# Altium project SurvBot-RCU.PrjPcb
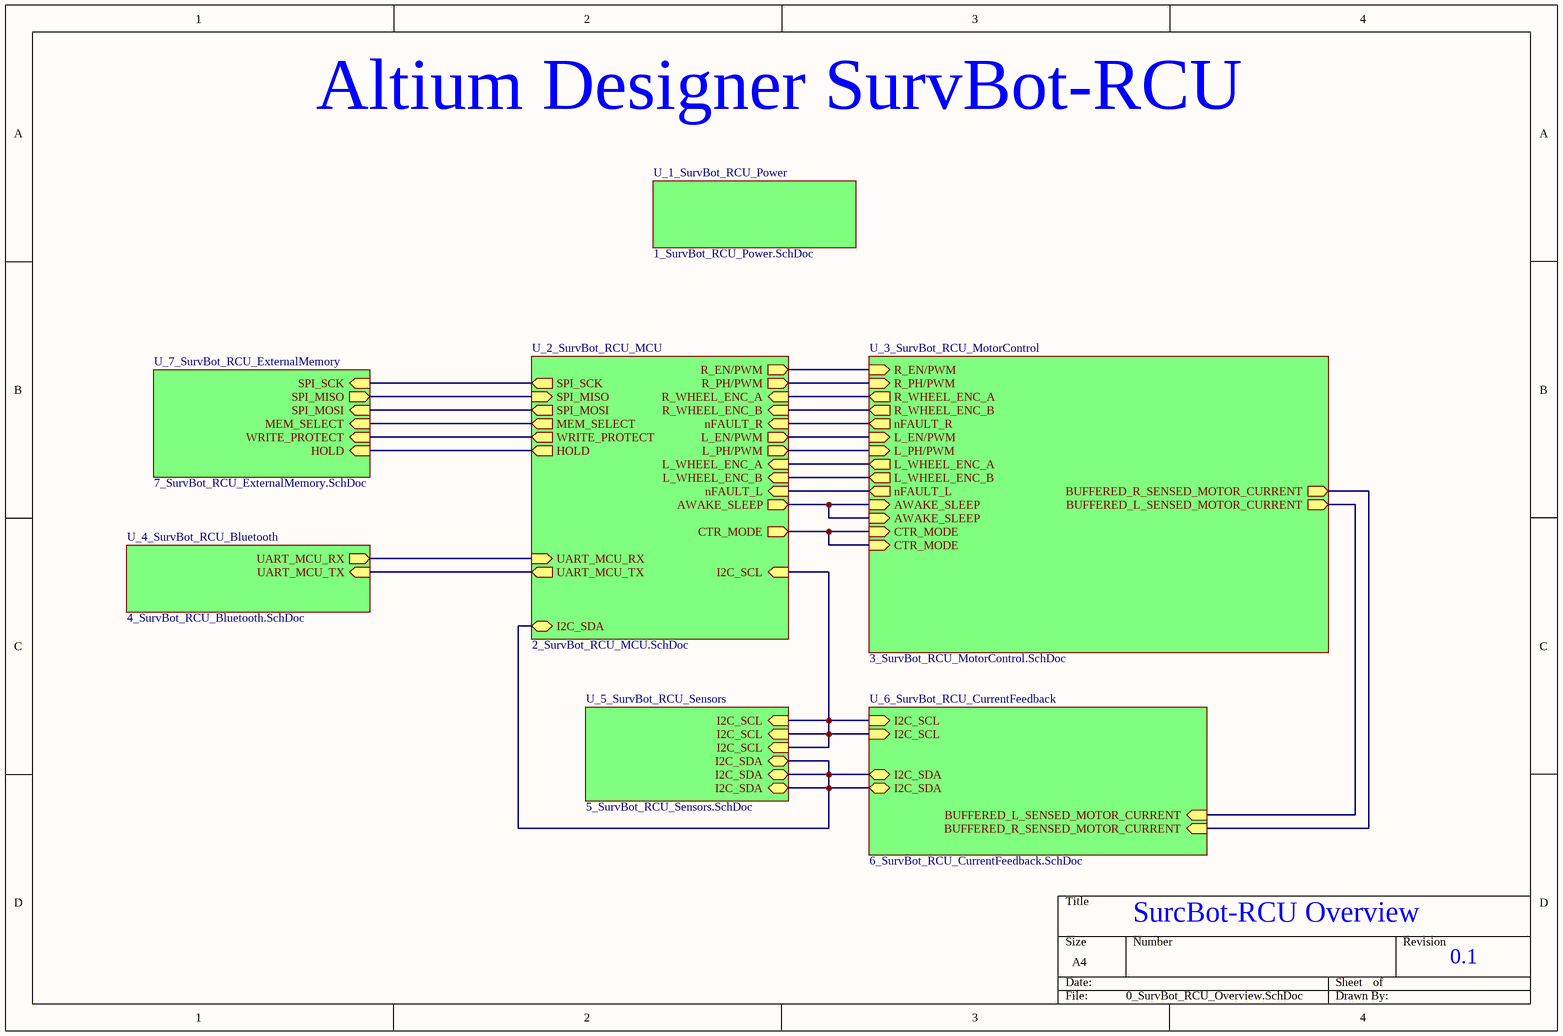
[diagram p0: 0_SurvBot_RCU_Overview.SchDoc]
8 sheets, 149 parts. Net scope: hierarchical (ports join the sheet entries above them; power ports are global).
Board file: SurvBot_RCU.PcbDoc
Sheets:
  0_SurvBot_RCU_Overview.SchDoc
    U_1_SurvBot_RCU_Power = 1_SurvBot_RCU_Power.SchDoc
    U_2_SurvBot_RCU_MCU = 2_SurvBot_RCU_MCU.SchDoc
    U_3_SurvBot_RCU_MotorControl = 3_SurvBot_RCU_MotorControl.SchDoc
    U_6_SurvBot_RCU_CurrentFeedback = 6_SurvBot_RCU_CurrentFeedback.SchDoc
    U_5_SurvBot_RCU_Sensors = 5_SurvBot_RCU_Sensors.SchDoc
    U_4_SurvBot_RCU_Bluetooth = 4_SurvBot_RCU_Bluetooth.SchDoc
    U_7_SurvBot_RCU_ExternalMemory = 7_SurvBot_RCU_ExternalMemory.SchDoc

## Sheet 0_SurvBot_RCU_Overview.SchDoc
size A4; SheetNumber: 1; SheetTotal: 8

### Sub-sheets
U_1_SurvBot_RCU_Power = 1_SurvBot_RCU_Power.SchDoc: no entries
U_2_SurvBot_RCU_MCU = 2_SurvBot_RCU_MCU.SchDoc: R_PH/PWM (out), R_EN/PWM (out), L_WHEEL_ENC_A (in), L_WHEEL_ENC_B (in), L_PH/PWM (out), L_EN/PWM (out), MEM_SELECT (out), SPI_MOSI (out), SPI_MISO (in), SPI_SCK (out), WRITE_PROTECT (out), HOLD (out), nFAULT_L (in), nFAULT_R (in), UART_MCU_TX (out), UART_MCU_RX (in), CTR_MODE (out), AWAKE_SLEEP (out), R_WHEEL_ENC_A (in), R_WHEEL_ENC_B (in), I2C_SDA (bidir), I2C_SCL (in)
U_3_SurvBot_RCU_MotorControl = 3_SurvBot_RCU_MotorControl.SchDoc: R_EN/PWM (in), R_PH/PWM (in), CTR_MODE (in), nFAULT_R (out), BUFFERED_R_SENSED_MOTOR_CURRENT (out), BUFFERED_L_SENSED_MOTOR_CURRENT (out), R_WHEEL_ENC_A (out), R_WHEEL_ENC_B (out), L_WHEEL_ENC_A (out), L_WHEEL_ENC_B (out), AWAKE_SLEEP (in), L_EN/PWM (in), L_PH/PWM (in), nFAULT_L (out), AWAKE_SLEEP (in), CTR_MODE (in)
U_4_SurvBot_RCU_Bluetooth = 4_SurvBot_RCU_Bluetooth.SchDoc: UART_MCU_TX (in), UART_MCU_RX (out)
U_5_SurvBot_RCU_Sensors = 5_SurvBot_RCU_Sensors.SchDoc: I2C_SDA (bidir), I2C_SCL (in), I2C_SDA (bidir), I2C_SCL (in), I2C_SDA (bidir), I2C_SCL (in)
U_6_SurvBot_RCU_CurrentFeedback = 6_SurvBot_RCU_CurrentFeedback.SchDoc: I2C_SCL (in), I2C_SDA (bidir), BUFFERED_R_SENSED_MOTOR_CURRENT (in), I2C_SCL (in), I2C_SDA (bidir), BUFFERED_L_SENSED_MOTOR_CURRENT (in)
U_7_SurvBot_RCU_ExternalMemory = 7_SurvBot_RCU_ExternalMemory.SchDoc: MEM_SELECT (in), SPI_MOSI (in), SPI_MISO (out), SPI_SCK (in), WRITE_PROTECT (in), HOLD (in)

### Nets
AWAKE_SLEEP: sheet U_2_SurvBot_RCU_MCU/AWAKE_SLEEP, sheet U_3_SurvBot_RCU_MotorControl/AWAKE_SLEEP, sheet U_3_SurvBot_RCU_MotorControl/AWAKE_SLEEP
BUFFERED_L_SENSED_MOTOR_CURRENT: sheet U_3_SurvBot_RCU_MotorControl/BUFFERED_L_SENSED_MOTOR_CURRENT, sheet U_6_SurvBot_RCU_CurrentFeedback/BUFFERED_L_SENSED_MOTOR_CURRENT
BUFFERED_R_SENSED_MOTOR_CURRENT: sheet U_3_SurvBot_RCU_MotorControl/BUFFERED_R_SENSED_MOTOR_CURRENT, sheet U_6_SurvBot_RCU_CurrentFeedback/BUFFERED_R_SENSED_MOTOR_CURRENT
CTR_MODE: sheet U_2_SurvBot_RCU_MCU/CTR_MODE, sheet U_3_SurvBot_RCU_MotorControl/CTR_MODE, sheet U_3_SurvBot_RCU_MotorControl/CTR_MODE
HOLD: sheet U_2_SurvBot_RCU_MCU/HOLD, sheet U_7_SurvBot_RCU_ExternalMemory/HOLD
I2C_SCL: sheet U_2_SurvBot_RCU_MCU/I2C_SCL, sheet U_6_SurvBot_RCU_CurrentFeedback/I2C_SCL, sheet U_6_SurvBot_RCU_CurrentFeedback/I2C_SCL, sheet U_5_SurvBot_RCU_Sensors/I2C_SCL, sheet U_5_SurvBot_RCU_Sensors/I2C_SCL, sheet U_5_SurvBot_RCU_Sensors/I2C_SCL
I2C_SDA: sheet U_2_SurvBot_RCU_MCU/I2C_SDA, sheet U_6_SurvBot_RCU_CurrentFeedback/I2C_SDA, sheet U_6_SurvBot_RCU_CurrentFeedback/I2C_SDA, sheet U_5_SurvBot_RCU_Sensors/I2C_SDA, sheet U_5_SurvBot_RCU_Sensors/I2C_SDA, sheet U_5_SurvBot_RCU_Sensors/I2C_SDA
L_EN/PWM: sheet U_2_SurvBot_RCU_MCU/L_EN/PWM, sheet U_3_SurvBot_RCU_MotorControl/L_EN/PWM
L_PH/PWM: sheet U_2_SurvBot_RCU_MCU/L_PH/PWM, sheet U_3_SurvBot_RCU_MotorControl/L_PH/PWM
L_WHEEL_ENC_A: sheet U_2_SurvBot_RCU_MCU/L_WHEEL_ENC_A, sheet U_3_SurvBot_RCU_MotorControl/L_WHEEL_ENC_A
L_WHEEL_ENC_B: sheet U_2_SurvBot_RCU_MCU/L_WHEEL_ENC_B, sheet U_3_SurvBot_RCU_MotorControl/L_WHEEL_ENC_B
MEM_SELECT: sheet U_2_SurvBot_RCU_MCU/MEM_SELECT, sheet U_7_SurvBot_RCU_ExternalMemory/MEM_SELECT
nFAULT_L: sheet U_2_SurvBot_RCU_MCU/nFAULT_L, sheet U_3_SurvBot_RCU_MotorControl/nFAULT_L
nFAULT_R: sheet U_2_SurvBot_RCU_MCU/nFAULT_R, sheet U_3_SurvBot_RCU_MotorControl/nFAULT_R
R_EN/PWM: sheet U_2_SurvBot_RCU_MCU/R_EN/PWM, sheet U_3_SurvBot_RCU_MotorControl/R_EN/PWM
R_PH/PWM: sheet U_2_SurvBot_RCU_MCU/R_PH/PWM, sheet U_3_SurvBot_RCU_MotorControl/R_PH/PWM
R_WHEEL_ENC_A: sheet U_2_SurvBot_RCU_MCU/R_WHEEL_ENC_A, sheet U_3_SurvBot_RCU_MotorControl/R_WHEEL_ENC_A
R_WHEEL_ENC_B: sheet U_2_SurvBot_RCU_MCU/R_WHEEL_ENC_B, sheet U_3_SurvBot_RCU_MotorControl/R_WHEEL_ENC_B
SPI_MISO: sheet U_2_SurvBot_RCU_MCU/SPI_MISO, sheet U_7_SurvBot_RCU_ExternalMemory/SPI_MISO
SPI_MOSI: sheet U_2_SurvBot_RCU_MCU/SPI_MOSI, sheet U_7_SurvBot_RCU_ExternalMemory/SPI_MOSI
SPI_SCK: sheet U_2_SurvBot_RCU_MCU/SPI_SCK, sheet U_7_SurvBot_RCU_ExternalMemory/SPI_SCK
UART_MCU_RX: sheet U_2_SurvBot_RCU_MCU/UART_MCU_RX, sheet U_4_SurvBot_RCU_Bluetooth/UART_MCU_RX
UART_MCU_TX: sheet U_2_SurvBot_RCU_MCU/UART_MCU_TX, sheet U_4_SurvBot_RCU_Bluetooth/UART_MCU_TX
WRITE_PROTECT: sheet U_2_SurvBot_RCU_MCU/WRITE_PROTECT, sheet U_7_SurvBot_RCU_ExternalMemory/WRITE_PROTECT

### Notes on the sheet
- Altium Designer SurvBot-RCU
- SurcBot-RCU Overview
- 0.1

## Sheet 1_SurvBot_RCU_Power.SchDoc
size A3; SheetNumber: 2; SheetTotal: 8
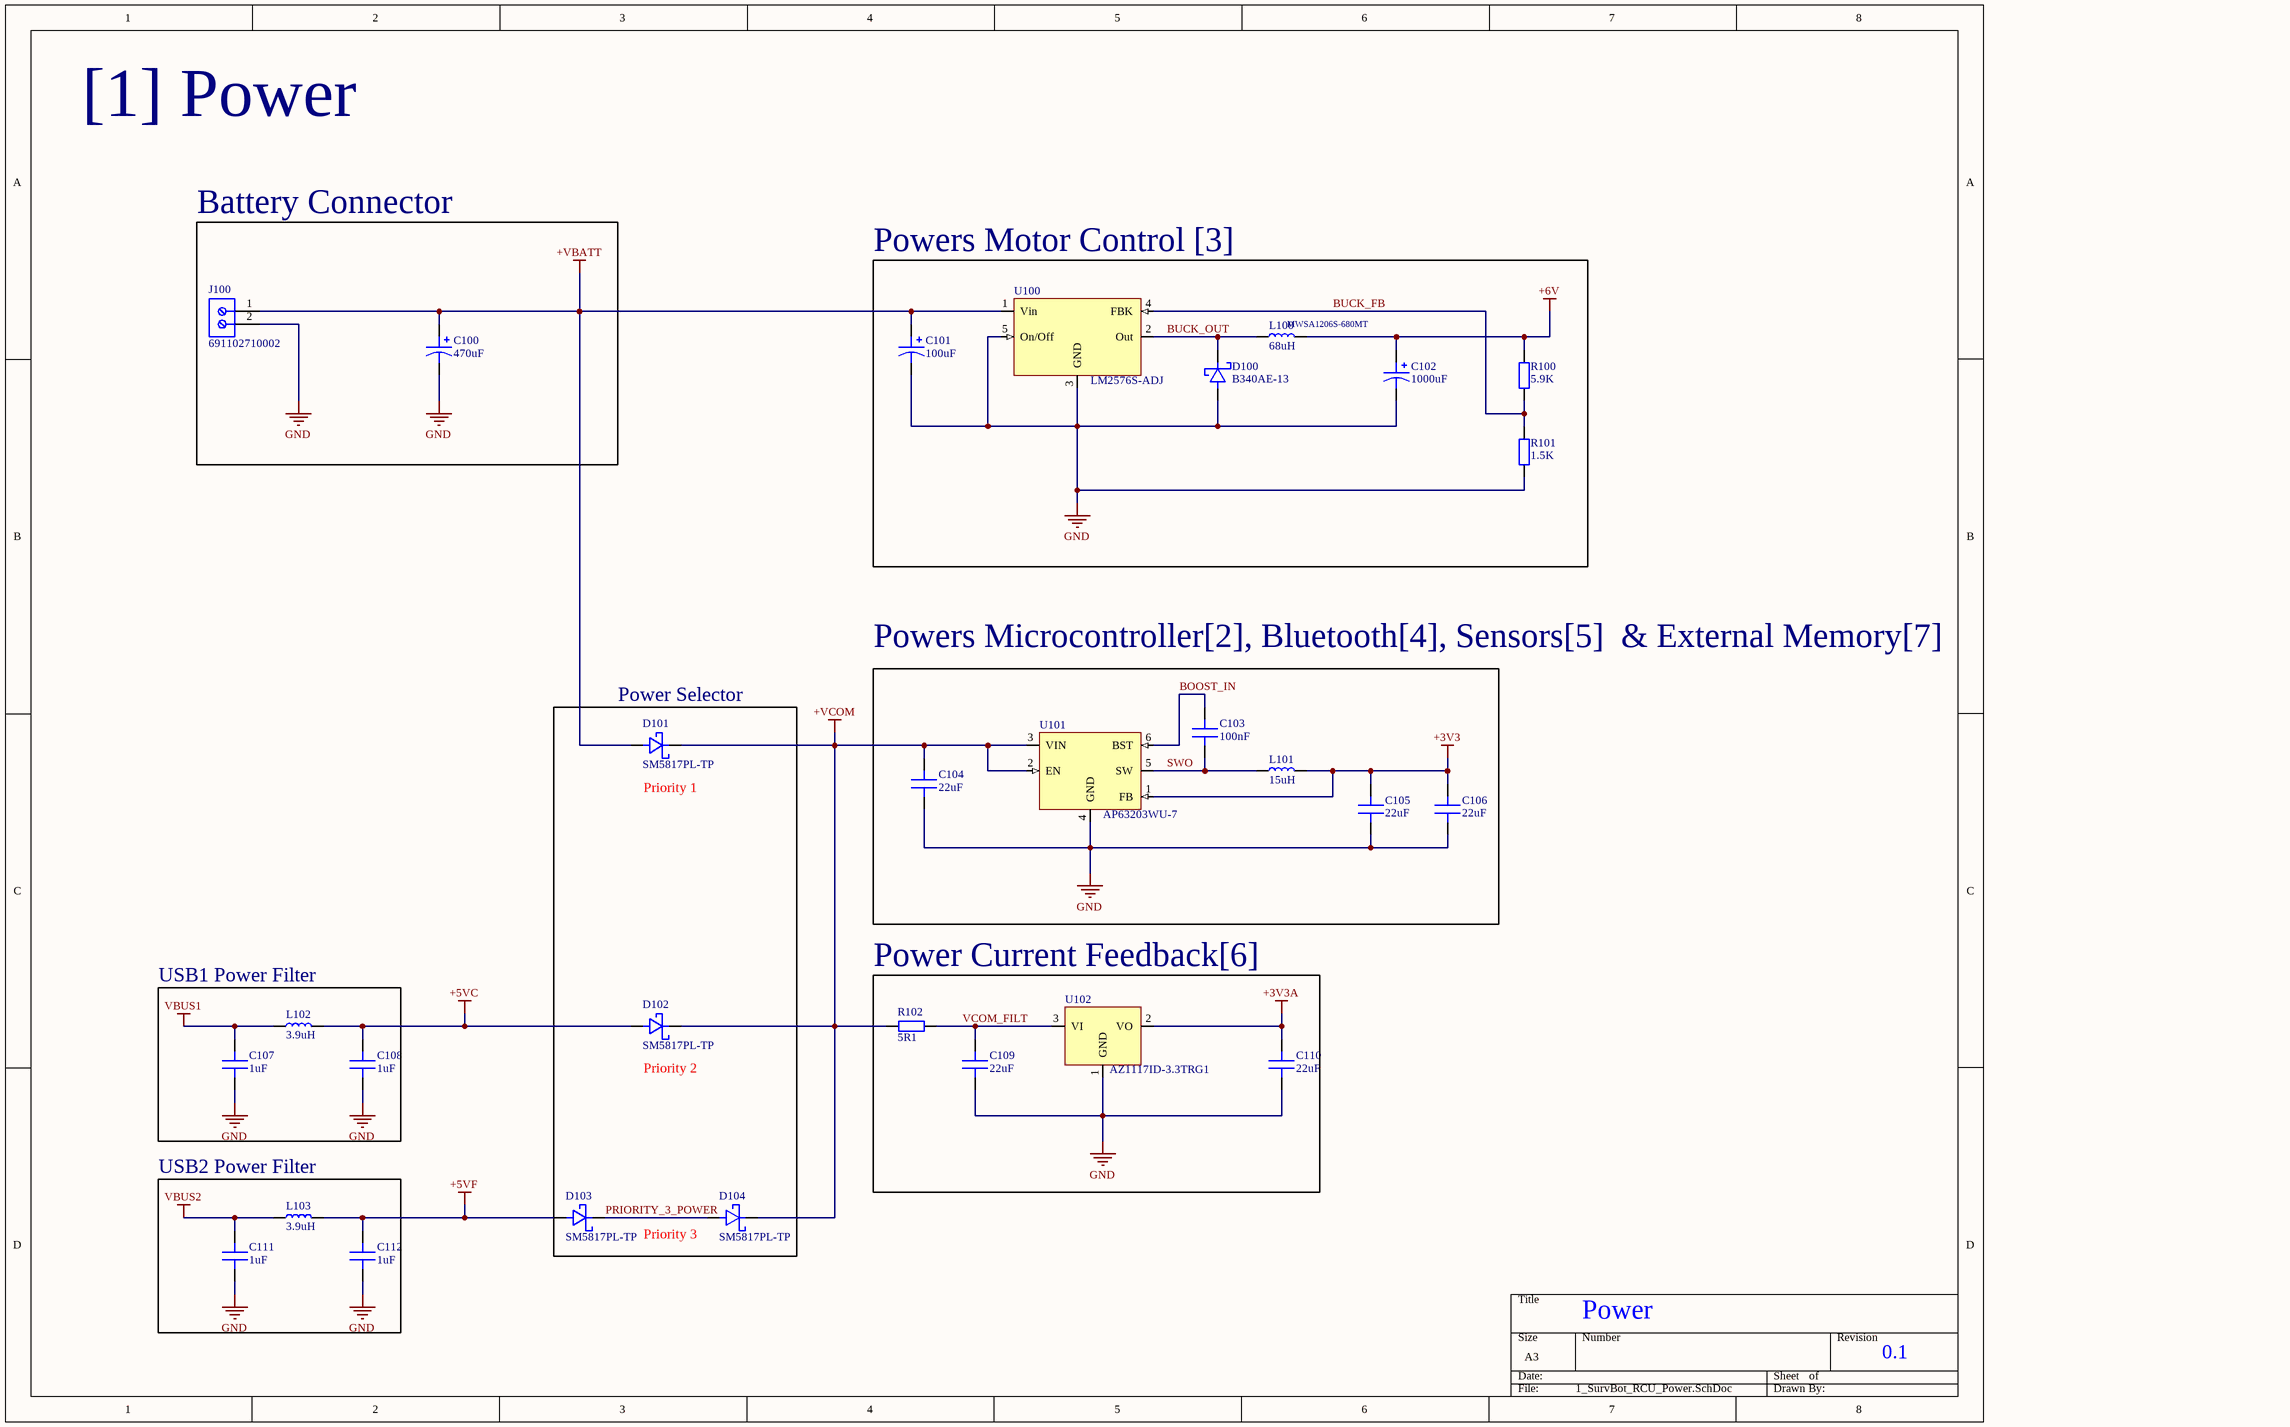
[diagram p1: 1_SurvBot_RCU_Power.SchDoc]

### Parts
C100  470uF  [CAP-THT_RADIAL_D10.00mm_P5.00mm]
C101  100uF  [CAP-THT-Radial__D8.0mmP3.5mm]
C102  1000uF  [CAP-THT_RADIAL_D10.00mm_P5.00mm]
C103  100nF  [CAP_0603]
C104  22uF  [CAP_0603]
C105  22uF  [CAP_0603]
C106  22uF  [CAP_0603]
C107  1uF  [CAP_0603]
C108  1uF  [CAP_0603]
C109  22uF  [CAP_0603]
C110  22uF  [CAP_0603]
C111  1uF  [CAP_0603]
C112  1uF  [CAP_0603]
D100  B340AE-13  [DO-214AC, SMA]
D101  SM5817PL-TP  [DIO-SOD-123FL]
D102  SM5817PL-TP  [DIO-SOD-123FL]
D103  SM5817PL-TP  [DIO-SOD-123FL]
D104  SM5817PL-TP  [DIO-SOD-123FL]
J100  691102710002  [691102710002]
L100  68uH  [IND-SMD_13.45x12.45mm]
L101  15uH  [IND-SMD_ 4.90x4.90mm]
L102  3.9uH  [IND_SMD-3.00MMX3.00MM]
L103  3.9uH  [IND_SMD-3.00MMX3.00MM]
R100  5.9K  [RES_0603]
R101  1.5K  [RES_0603]
R102  5R1  [RES_1206]
U100  LM2576S-ADJ  [TO-263-6, D2PAK (5 Leads + Tab), TO-263BA]
U101  AP63203WU-7  [SOT-23-6 Thin, TSOT-23-6]
U102  AZ1117ID-3.3TRG1  [TO-252-3, DPAK (2 Leads + Tab), SC-63]

### Blocks framed on the sheet
Battery Connector: C100 J100
Powers Motor Control [3]: C101 C102 D100 L100 R100 R101 U100
Power Selector: D101-D104
Power Current Feedback[6]: C109 C110 R102 U102
USB1 Power Filter: C107 C108 L102
USB2 Power Filter: C111 C112 L103

### Nets
+3V3: C105.2 C106.2 L101.2 U101.1(FB)
+3V3A: C110.2 U102.2(VO)
+5VC: C108.2 D102.A L102.2
+5VF: C112.2 D103.A L103.2
+6V: C102.1 L100.2 R100.2
+VBATT: C100.1 C101.1 D101.A J100.1 U100.1(Vin)
+VCOM: C104.2 D101.K D102.K D104.K R102.1 U101.2(EN) U101.3(VIN)
GND: C100.2 C101.2 C102.2 C104.1 C105.1 C106.1 C107.1 C108.1 C109.1 C110.1 C111.1 C112.1 D100.A J100.2 R101.1 U100.3(GND) U100.5(On/Off) U101.4(GND) U102.1(GND)
VBUS1: C107.2 L102.1
VBUS2: C111.2 L103.1
BOOST_IN: C103.2 U101.6(BST)
BUCK_FB: R100.1 R101.2 U100.4(FBK)
BUCK_OUT: D100.K L100.1 U100.2(Out)
PRIORITY_3_POWER: D103.K D104.A
SWO: C103.1 L101.1 U101.5(SW)
VCOM_FILT: C109.2 R102.2 U102.3(VI)

### Notes on the sheet
- [1] Power
- (near L100) MWSA1206S-680MT
- Powers Microcontroller[2], Bluetooth[4], Sensors[5]  & External Memory[7]
- (near D101) Priority 1
- (near D102) Priority 2
- (near D104) Priority 3
- Power
- 0.1

### Library data of the parts
C100 = CAP_470uF-35V-20%-RADIAL-TH: 470 µF 35 V Aluminum Electrolytic Capacitors Radial, Can 10000 Hrs @ 105°C; Manufacturer: Rubycon; Manufacturer Part #: 35ZLH470MEFC10X16; Case/Package: TH,D10xL16mm; Supplier: JLCPCB; Supplier Part #: C338196
C101 = CAP_100uF-50V-20%-RADIAL-TH: 100 µF 50 V Aluminum Electrolytic Capacitors Radial, Can 8000 Hrs @ 105°C; Manufacturer: Rubycon; Manufacturer Part #: 50ZLH100MEFC8X11.5; Case/Package: TH,D8xL11.5mm; Supplier: JLCPCB; Supplier Part #: C109393
C102 = CAP_1000uF-16V-20%-RADIAL-TH: 1000 µF 16 V Aluminum Electrolytic Capacitors Radial, Can 10000 Hrs @ 105°C; Manufacturer: Rubycon; Manufacturer Part #: 16ZLH1000MEFC10X16; Case/Package: TH,D10xL16mm; Supplier: JLCPCB; Supplier Part #: C338175
C103 = CAP_100nF-50V-10%-0603: 0.1 µF ±10% 50V Ceramic Capacitor X7R 0603 (1608 Metric); Manufacturer: KEMET; Manufacturer Part #: C0603C104K5RACAUTO; Case/Package: 0603; Supplier: JLCPCB; Supplier Part #: C129621
C104-C106 C109 C110 = CAP_22uF-10V-20%-0603: 22 µF ±20% 10V Ceramic Capacitor X5R 0603 (1608 Metric); Manufacturer: Samsung Electro-Mechanics; Manufacturer Part #: CL10A226MP8NUNE; Case/Package: 0603; Supplier: JLCPCB; Supplier Part #: C86295
C107 C108 C111 C112 = CAP_1uF-16V-10%-0603: 1 µF ±10% 16V Ceramic Capacitor X7R 0603 (1608 Metric); Manufacturer: YAGEO; Manufacturer Part #: CC0603KRX7R7BB105; Case/Package: 0603; Supplier: JLCPCB; Supplier Part #: C106248
D100 = DIO-S_0.5V-40V-3A-SMA: Diode 40 V 3A Surface Mount SMA; Manufacturer: DIODES INCORPORATED; Manufacturer Part #: B340AE-13; Case/Package: SMA; Supplier: JLCPCB; Supplier Part #: C168859
D101-D104 = DIO-S_0.45V-20V-1A-SOD-123FL: Diode 20 V 1A Surface Mount SOD-123FL; Manufacturer: MCC(Micro Commercial Components); Manufacturer Part #: SM5817PL-TP; Case/Package: SOD-123FL; Supplier: JLCPCB; Supplier Part #: C669022
J100 = CMP-1502-03258-2: NexarPartId: 8917706; Number of Levels: 1; Number of Positions Per Level: 2; Current: 15A; Voltage: 300V; Pitch: 5.0038mm; Plating: Steel; Stripping Length: -6mm; Wire Gauge (Min): 14AWG; Wire Gauge (Max): 22AWG; Length: 7.5mm; Contact Material: Brass; Contact Plating: Tin; Packaging: Box; Number of Pins: 2; Voltage Rating: 300V; Termination: Screw; Number of Contacts: 2; Color: Blue; Current Rating: 15A; Mount: Through Hole; Max Operating Temperature: 105°C; Min Operating Temperature: -40°C; REACH SVHC: Unknown; Height: 13.4mm; Width: 11.2mm; Housing Material: Nylon; RoHS: Compliant; Wire/Cable Gauge: 22AWG; Lead Pitch: 5mm
L100 = IND_68uH-4A-20%-SMD: 68 µH Shielded Drum Core, Wirewound Inductor 4 A 140mOhm Max Nonstandard; Manufacturer: Sunlord; Manufacturer Part #: MWSA1206S-680MT; Case/Package: SMD,13.5x12.6mm; Supplier: JLCPCB; Supplier Part #: C408532
L101 = IND_15uH-1.2A-20%-SMD: 15 µH Shielded Drum Core, Wirewound Inductor 1.2 A 198mOhm Max Nonstandard; Manufacturer: Taiyo Yuden; Manufacturer Part #: NRS5020T150MMGJ; Case/Package: SMD,4.9x4.9mm; Supplier: JLCPCB; Supplier Part #: C222920
L102 L103 = IND_3.9uH-2.1A-20%-SMD: 3.9 µH Shielded Drum Core, Wirewound Inductor 1.5 A 115mOhm Max Nonstandard; Manufacturer: Sunlord; Manufacturer Part #: SPH3015H3R9MT; Case/Package: SMD,3x3mm; Supplier: JLCPCB; Supplier Part #: C431700
R100 = RES_5.9K-100mW-1%-0603: RES 5.9K OHM 1% 100mW SMD-0603 Thick film Resistor; Manufacturer: PANASONIC; Manufacturer Part #: ERJ3EKF5901V; Case/Package: 0603; Supplier: JLCPCB; Supplier Part #: C403290
R101 = RES_1.5K-250mW-1%-0603: RES 1.5K OHM 1% 250mW SMD-0603 Thick film Resistor; Manufacturer: PANASONIC; Manufacturer Part #: ERJPA3F1501V; Case/Package: 0603; Supplier: JLCPCB; Supplier Part Number: C543357
R102 = RES_5R1-600mW-5%-1206: 600mW Thick Film Resistors 200V ±5% ±400ppm/℃ 5.1Ω 1206 Chip Resistor - Surface Mount; Manufacturer: UNI-ROYAL(Uniroyal Elec); Manufacturer Part #: AS0606J051JT5E; Case/Package: 1206; Supplier: JLCPCB; Supplier Part #: C966043
U100 = LM2576S-ADJ: Buck Switching Regulator IC Positive Adjustable 1 Output 3A TO-263-6, D2PAK (5 Leads + Tab), TO-263BA; Manufacturer: UMW(Youtai Semiconductor Co., Ltd.); Manufacturer Part #: LM2576S-ADJ; Case/Package: TO-263-5; Supplier: JLCPCB; Supplier Part #: C347415
U101 = AP63203WU-7 TSOT-23-6: Buck Switching Regulator IC Positive Fixed 3.3V 1 Output 2A SOT-23-6 Thin, TSOT-23-6; Manufacturer: Diodes Incorporated; Manufacturer Part #: AP63203WU-7; Case/Package: TSOT-23-6; Supplier: JLCPCB; Supplier Part #: C780769
U102 = AZ1117ID-3.3TRG1: Linear Voltage Regulator IC Positive Fixed 1 Output 1A TO-252-3; Manufacturer: Diodes Incorporated; Manufacturer Part #: AZ1117ID-3.3TRG1; Case/Package: TO-252-2; Supplier: JLCPCB; Supplier Part #: C2926306

## Sheet 2_SurvBot_RCU_MCU.SchDoc
size A4; SheetNumber: 3; SheetTotal: 8
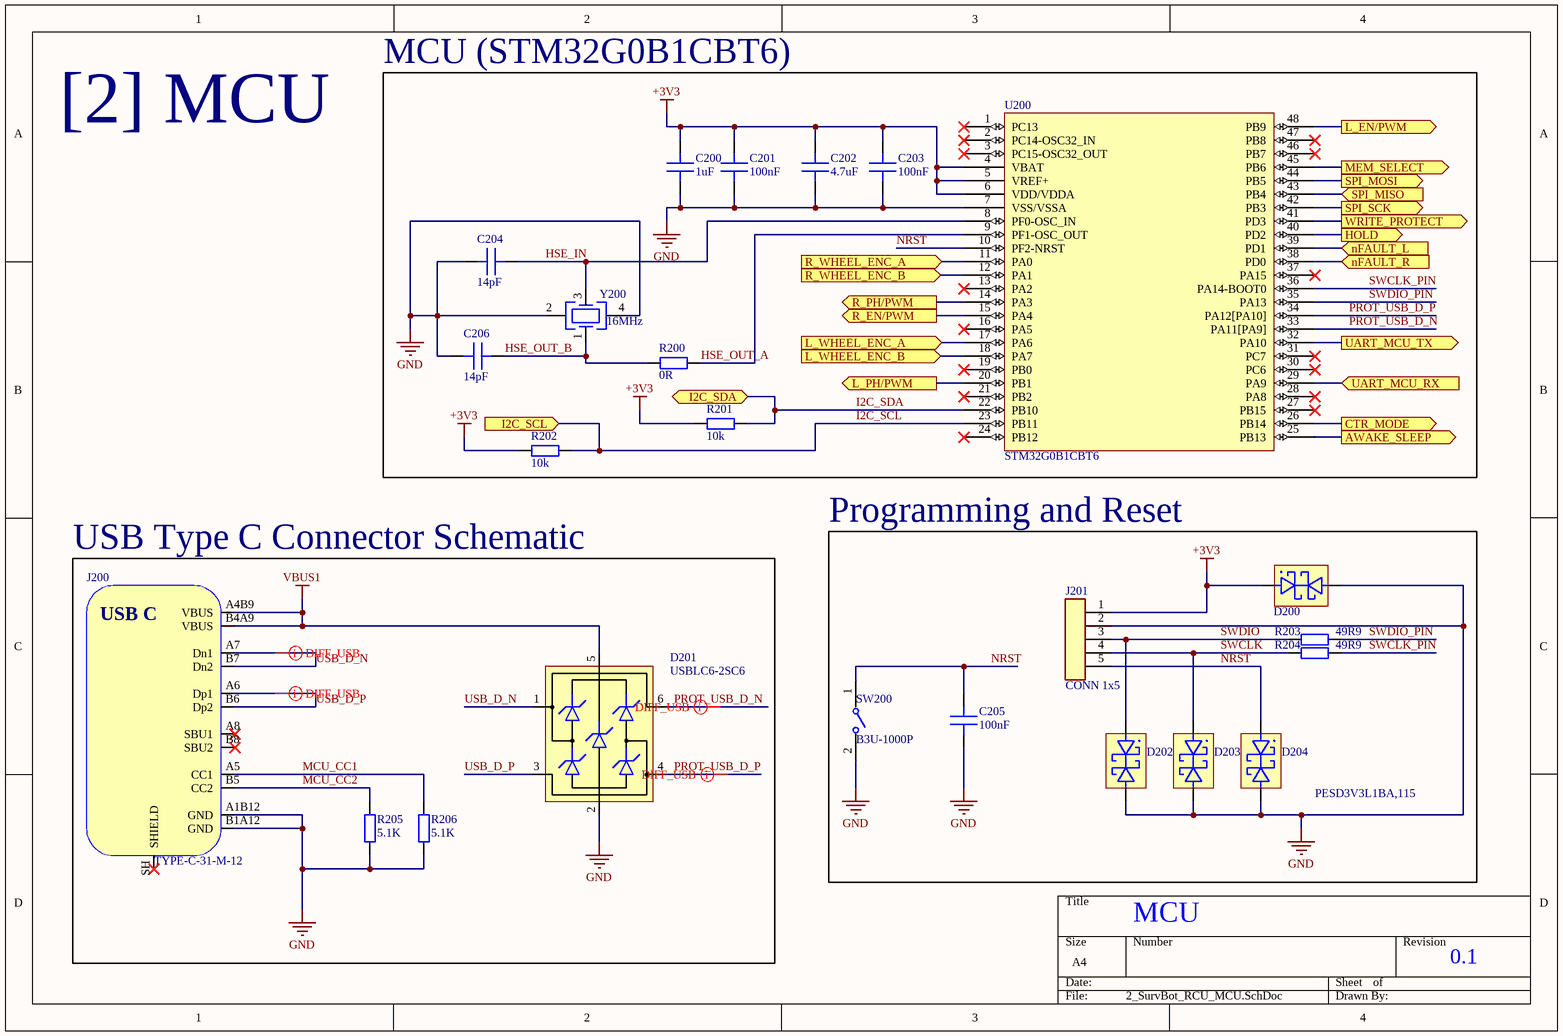
[diagram p2: 2_SurvBot_RCU_MCU.SchDoc]

### Parts
C200  1uF  [CAP_0402]
C201  100nF  [CAP_0402]
C202  4.7uF  [CAP_0402]
C203  100nF  [CAP_0402]
C204  14pF  [CAP_0402]
C205  100nF  [CAP_0402]
C206  14pF  [CAP_0402]
D200  PESD3V3L1BA,115  [SC-76, SOD-323]  (value not drawn)
D201  USBLC6-2SC6  [SOT-23-6]
D202  PESD3V3L1BA,115  [SC-76, SOD-323]  (value not drawn)
D203  PESD3V3L1BA,115  [SC-76, SOD-323]  (value not drawn)
D204  PESD3V3L1BA,115  [SC-76, SOD-323]  (value not drawn)
J200  TYPE-C-31-M-12  [USB4105-GF-A-060]
J201  CONN 1x5  [2541FV-5P]
R200  0R  [RES_0402]
R201  10k  [RES_0402]
R202  10k  [RES_0402]
R203  49R9  [RES_0603]
R204  49R9  [RES_0603]
R205  5.1K  [RES_0603]
R206  5.1K  [RES_0603]
SW200  B3U-1000P  [FP-B3U-1000P-MFG]
U200  STM32G0B1CBT6  [48-LQFP (7x7mm)]
Y200  16MHz  [SMD3225-4P]

### Blocks framed on the sheet
MCU (STM32G0B1CBT6): C200-C204 C206 R200-R202 U200 Y200
USB Type C Connector Schematic: D201 J200 R205 R206
Programming and Reset: C205 D200 D202-D204 J201 R203 R204 SW200

### Ports
AWAKE_SLEEP (out, see 0_SurvBot_RCU_Overview[3B], 3_SurvBot_RCU_MotorControl[4A], 3_SurvBot_RCU_MotorControl[4C]), CTR_MODE (out, see 0_SurvBot_RCU_Overview[3C], 3_SurvBot_RCU_MotorControl[6A], 3_SurvBot_RCU_MotorControl[6C]), HOLD (out, see 0_SurvBot_RCU_Overview[2B], 7_SurvBot_RCU_ExternalMemory[1C]), I2C_SCL (in, see 0_SurvBot_RCU_Overview[3C], 5_SurvBot_RCU_Sensors[1B], 5_SurvBot_RCU_Sensors[2D], 5_SurvBot_RCU_Sensors[3B], 6_SurvBot_RCU_CurrentFeedback[1B], 6_SurvBot_RCU_CurrentFeedback[1C]), I2C_SDA (bidir, see 0_SurvBot_RCU_Overview[2C], 5_SurvBot_RCU_Sensors[1B], 5_SurvBot_RCU_Sensors[2C], 5_SurvBot_RCU_Sensors[3B], 6_SurvBot_RCU_CurrentFeedback[1B], 6_SurvBot_RCU_CurrentFeedback[1C]), L_EN/PWM (out, see 0_SurvBot_RCU_Overview[3B], 3_SurvBot_RCU_MotorControl[4C]), L_PH/PWM (out, see 0_SurvBot_RCU_Overview[3B], 3_SurvBot_RCU_MotorControl[4C]), L_WHEEL_ENC_A (in, see 0_SurvBot_RCU_Overview[3B], 3_SurvBot_RCU_MotorControl[5D]), L_WHEEL_ENC_B (in, see 0_SurvBot_RCU_Overview[3B], 3_SurvBot_RCU_MotorControl[7D]), MEM_SELECT (out, see 0_SurvBot_RCU_Overview[2B], 7_SurvBot_RCU_ExternalMemory[1C]), nFAULT_L (in, see 0_SurvBot_RCU_Overview[3B], 3_SurvBot_RCU_MotorControl[4C]), nFAULT_R (in, see 0_SurvBot_RCU_Overview[3B], 3_SurvBot_RCU_MotorControl[4A]), R_EN/PWM (out, see 0_SurvBot_RCU_Overview[3B], 3_SurvBot_RCU_MotorControl[4A]), R_PH/PWM (out, see 0_SurvBot_RCU_Overview[3B], 3_SurvBot_RCU_MotorControl[4A]), R_WHEEL_ENC_A (in, see 0_SurvBot_RCU_Overview[3B], 3_SurvBot_RCU_MotorControl[5B]), R_WHEEL_ENC_B (in, see 0_SurvBot_RCU_Overview[3B], 3_SurvBot_RCU_MotorControl[6B]), SPI_MISO (in, see 0_SurvBot_RCU_Overview[2B], 7_SurvBot_RCU_ExternalMemory[3C]), SPI_MOSI (out, see 0_SurvBot_RCU_Overview[2B], 7_SurvBot_RCU_ExternalMemory[1C]), SPI_SCK (out, see 0_SurvBot_RCU_Overview[2B], 7_SurvBot_RCU_ExternalMemory[1C]), UART_MCU_RX (in, see 0_SurvBot_RCU_Overview[2C], 4_SurvBot_RCU_Bluetooth[1C]), UART_MCU_TX (out, see 0_SurvBot_RCU_Overview[2C], 4_SurvBot_RCU_Bluetooth[1C]), WRITE_PROTECT (out, see 0_SurvBot_RCU_Overview[2B], 7_SurvBot_RCU_ExternalMemory[1C])

### Nets
+3V3: C200.2 C201.2 C202.2 C203.2 D200.K1 J201.1 R201.1 R202.2 U200.4(VBAT) U200.5(VREF+) U200.6(VDD/VDDA)
GND: C200.1 C201.1 C202.1 C203.1 C204.1 C205.1 C206.1 D200.K2 D201.2(GND) D202.K2 D203.K2 D204.K2 J200.A1B12(GND) J200.B1A12(GND) J201.2 R205.1 R206.1 SW200.2 U200.7(VSS/VSSA) Y200.2(GND) Y200.4(GND)
VBUS1: D201.5(VBUS) J200.A4B9(VBUS) J200.B4A9(VBUS)
AWAKE_SLEEP: U200.25(PB13) ; port AWAKE_SLEEP
CTR_MODE: U200.26(PB14) ; port CTR_MODE
HOLD: U200.40(PD2) ; port HOLD
HSE_IN: C204.2 U200.8(PF0-OSC_IN) Y200.3(OSC)
HSE_OUT_A: R200.2 U200.9(PF1-OSC_OUT)
HSE_OUT_B: C206.2 R200.1 Y200.1(OSC)
I2C_SCL: R202.1 U200.23(PB11) ; port I2C_SCL
I2C_SDA: R201.2 U200.22(PB10) ; port I2C_SDA
L_EN/PWM: U200.48(PB9) ; port L_EN/PWM
L_PH/PWM: U200.20(PB1) ; port L_PH/PWM
L_WHEEL_ENC_A: U200.17(PA6) ; port L_WHEEL_ENC_A
L_WHEEL_ENC_B: U200.18(PA7) ; port L_WHEEL_ENC_B
MCU_CC1: J200.A5(CC1) R206.2
MCU_CC2: J200.B5(CC2) R205.2
MEM_SELECT: U200.45(PB6) ; port MEM_SELECT
nFAULT_L: U200.39(PD1) ; port nFAULT_L
nFAULT_R: U200.38(PD0) ; port nFAULT_R
NRST: C205.2 D204.K1 J201.5 SW200.1 U200.10(PF2-NRST)
PROT_USB_D_N: D201.6(IO1) U200.33(PA11[PA9])
PROT_USB_D_P: D201.4(IO2) U200.34(PA12[PA10])
R_EN/PWM: U200.15(PA4) ; port R_EN/PWM
R_PH/PWM: U200.14(PA3) ; port R_PH/PWM
R_WHEEL_ENC_A: U200.11(PA0) ; port R_WHEEL_ENC_A
R_WHEEL_ENC_B: U200.12(PA1) ; port R_WHEEL_ENC_B
SPI_MISO: U200.43(PB4) ; port SPI_MISO
SPI_MOSI: U200.44(PB5) ; port SPI_MOSI
SPI_SCK: U200.42(PB3) ; port SPI_SCK
SWCLK: D203.K1 J201.4 R204.1
SWCLK_PIN: R204.2 U200.36(PA14-BOOT0)
SWDIO: D202.K1 J201.3 R203.1
SWDIO_PIN: R203.2 U200.35(PA13)
UART_MCU_RX: U200.29(PA9) ; port UART_MCU_RX
UART_MCU_TX: U200.32(PA10) ; port UART_MCU_TX
USB_D_N: D201.1(IO1) J200.A7(Dn1) J200.B7(Dn2)
USB_D_P: D201.3(IO2) J200.A6(Dp1) J200.B6(Dp2)
WRITE_PROTECT: U200.41(PD3) ; port WRITE_PROTECT

Not connected (* = marked no-connect by the designer): J200 A8(SBU1)* B8(SBU2)* SH(SHIELD)*; U200 1(PC13)* 2(PC14-OSC32_IN)* 3(PC15-OSC32_OUT)* 13(PA2)* 16(PA5)* 19(PB0)* 21(PB2)* 24(PB12)* 27(PB15)* 28(PA8)* 30(PC6)* 31(PC7)* 37(PA15)* 46(PB7)* 47(PB8)*

### Layout directives
differential pair; differential pair class USB: PROT_USB_D_N, PROT_USB_D_P, USB_D_N, USB_D_P

### Notes on the sheet
- [2] MCU
- PESD3V3L1BA,115
- MCU
- 0.1
- (in symbol USB4105-GF-A-060_1) USB C

### Library data of the parts
C200 = CAP_1uF-16V-10%-0402: 1 µF ±10% 16V Ceramic Capacitor X5R 0402 (1005 Metric); Manufacturer: Samsung Electro-Mechanics; Manufacturer Part #: CL05A105KO5NNNC; Case/Package: 0402; Supplier: JLCPCB; Supplier Part #: C29266
C201 C203 C205 = CAP_100nF-10V-10%-0402: 0.1 µF ±10% 10V Ceramic Capacitor X7R 0402 (1005 Metric); Manufacturer: Samsung Electro-Mechanics; Manufacturer Part #: CL05B104KP5NNNC; Case/Package: 0402; Supplier: JLCPCB; Supplier Part #: C133086
C202 = CAP_4.7uF-10V-20%-0402: 4.7 µF ±20% 10V Ceramic Capacitor X5R 0402 (1005 Metric); Manufacturer: Samsung Electro-Mechanics; Manufacturer Part #: CL05A475MP5NRNC; Case/Package: 0402; Supplier: JLCPCB; Supplier Part #: Supplier Part #
C204 C206 = CAP_14pF-50V-5%-0402: 50V 14pF NP0 ±5% 0402 Multilayer Ceramic Capacitors MLCC - SMD/SMT ROHS; Manufacturer: Walsin Tech Corp; Manufacturer Part #: 0402N140J500CT; Case/Package: 0402; Supplier: JLCPCB; Supplier Part #: C458857
D200 D202-D204 = DIO-TVS_3.3V-26V-18A-SOD-323: 26V Clamp 18A (8/20µs) Ipp Tvs Diode Surface Mount SOD-323; Manufacturer: Nexperia; Manufacturer Part #: PESD3V3L1BA,115; Case/Package: SOD-323; Supplier: JLCPCB; Supplier Part #: C51450
D201 = USBLC6-2SC6: Low-Capacitance ESD Protection USB; Manufacturer: STMicroelectronics; Manufacturer Part Number: USBLC6-2SC6; Distributor Link: https://www.mouser.de/ProductDetail/STMicroelectronics/USBLC6-2SC6?qs=po45yt2pPpu%2FhNIlwQdTlg%3D%3D
J200 = USB4105-GF-A-060_1: 5A 1 16P Female Type-C SMD USB Connectors ROHS; Manufacturer: Korean Hroparts Elec; Manufacturer Part Number: TYPE-C-31-M-12; Package: SMD; Supplier: JLCPCB; Supplier Part #: C165948
J201 = CONN_5_HDR_0.1-2541FV-5P: 2.54mm 3A Single Row -40℃~+105℃ 250V 5P Direct Insert 1x5P Top Square Hole Plugin,P=2.54mm Female Headers ROHS; Manufacturer: HanElectricity; Manufacturer Part #: 2541FV-5P; Case/Package: P=2.54mm; Supplier: JLCPCB; Supplier Part #: C18723050
R200 = RES_0R-62.5mW-5%-0402: 0 Ohms Jumper Chip Resistor 0402 (1005 Metric) Moisture Resistant Thick Film; Manufacturer: YAGEO; Manufacturer Part #: RC0402JR-070RL; Case/Package: 0402; Supplier: JLCPCB; Supplier Part #: C60485
R201 R202 = RES_10K-62.5mW-1%-0402: 10 kOhms ±1% 0.063W, 1/16W Chip Resistor 0402 (1005 Metric) Moisture Resistant Thick Film; Manufacturer: YAGEO; Manufacturer Part #: RC0402FR-0710KL; Case/Package: 0402; Supplier: JLCPCB; Supplier Part #: C60490
R203 R204 = RES_49.R9-100mW-1%-0603: 49.9 Ohms ±1% 0.1W, 1/10W Chip Resistor 0603 (1608 Metric) Automotive AEC-Q200 Thick Film; Manufacturer: PANASONIC; Manufacturer Part #: ERJ3EKF49R9V; Case/Package: 0603; Supplier: JLCPCB; Supplier Part #: C403255
R205 R206 = RES_5.1K-100mW-1%-0603: 5.1 kOhms ±1% 0.1W, 1/10W Chip Resistor 0603 (1608 Metric) Moisture Resistant Thick Film; Manufacturer: YAGEO; Manufacturer Part #: RC0603FR-075K1L; Case/Package: 0603; Supplier: JLCPCB; Supplier Part #: C105580
SW200 = CMP-2100-03586-2: SWITCH TACTILE SPST-NO 0.05A 12V; Manufacturer: Omron Electronics; Contact Resistance: 100mR; Operating Force: 1.5N; Max Current Rating: 50mA; Switch Travel: 0.15mm; Actuator Type: Standard; Mechanical Life: 200000Cycles; Ratings: Dust Proof; Illumination Type: Non-Illuminated; Throw Configuration: SPST; Actuator Length: 0.4mm; Switch Function: Off-Mom; Height: 1.2mm; Width: 3mm; Weight: 0.000776oz; Contact Material: Silver; Max Voltage Rating (DC): 12V; Insulation Resistance: 100MR; Lead Free: Lead Free; Current Rating: 50mA; Termination: SMD/SMT; Length: 4mm; Voltage Rating (DC): 12V; Contact Current Rating: 50mA; Orientation: Straight; Depth: 2.5mm; Max Operating Temperature: 70°C; Packaging: Tape and Reel; Min Operating Temperature: -25°C; Package Quantity: 1; Mount: Surface Mount; Electrical Life: 200000Cycles; Manufacturer Part #: B3U-1000P; Case/Package: SMD, 2.5x3mm; Supplier: JLCPCB; Supplier Part #: C231329
U200 = STM32G0B1CBT6: ARM® Cortex®-M0+ STM32G0 Microcontroller IC 32-Bit Single-Core 64MHz 128KB (128K x 8) FLASH 48-LQFP (7x7); Manufacturer: STMicroelectronics; Manufacturer Part #: STM32G0B1CBT6; Case/Package: 48-LQFP (7x7); Supplier: JLCPCB; Supplier Part #: C2847904
Y200 = XTAL_16MHz_SMD3225-4P: 16MHz SMD crystal oscillator 12pF ±10ppm ±30ppm SMD3225-4P Crystals ROHS; Manufacturer: SJK(SHENZHEN CRYSTAL TECH); Manufacturer Part #: 7U16000E12UCG; Case/Package: SMD3225-4P; Supplier: JLCPCB; Supplier Part #: C251610

## Sheet 3_SurvBot_RCU_MotorControl.SchDoc
size A3; SheetNumber: 4; SheetTotal: 8
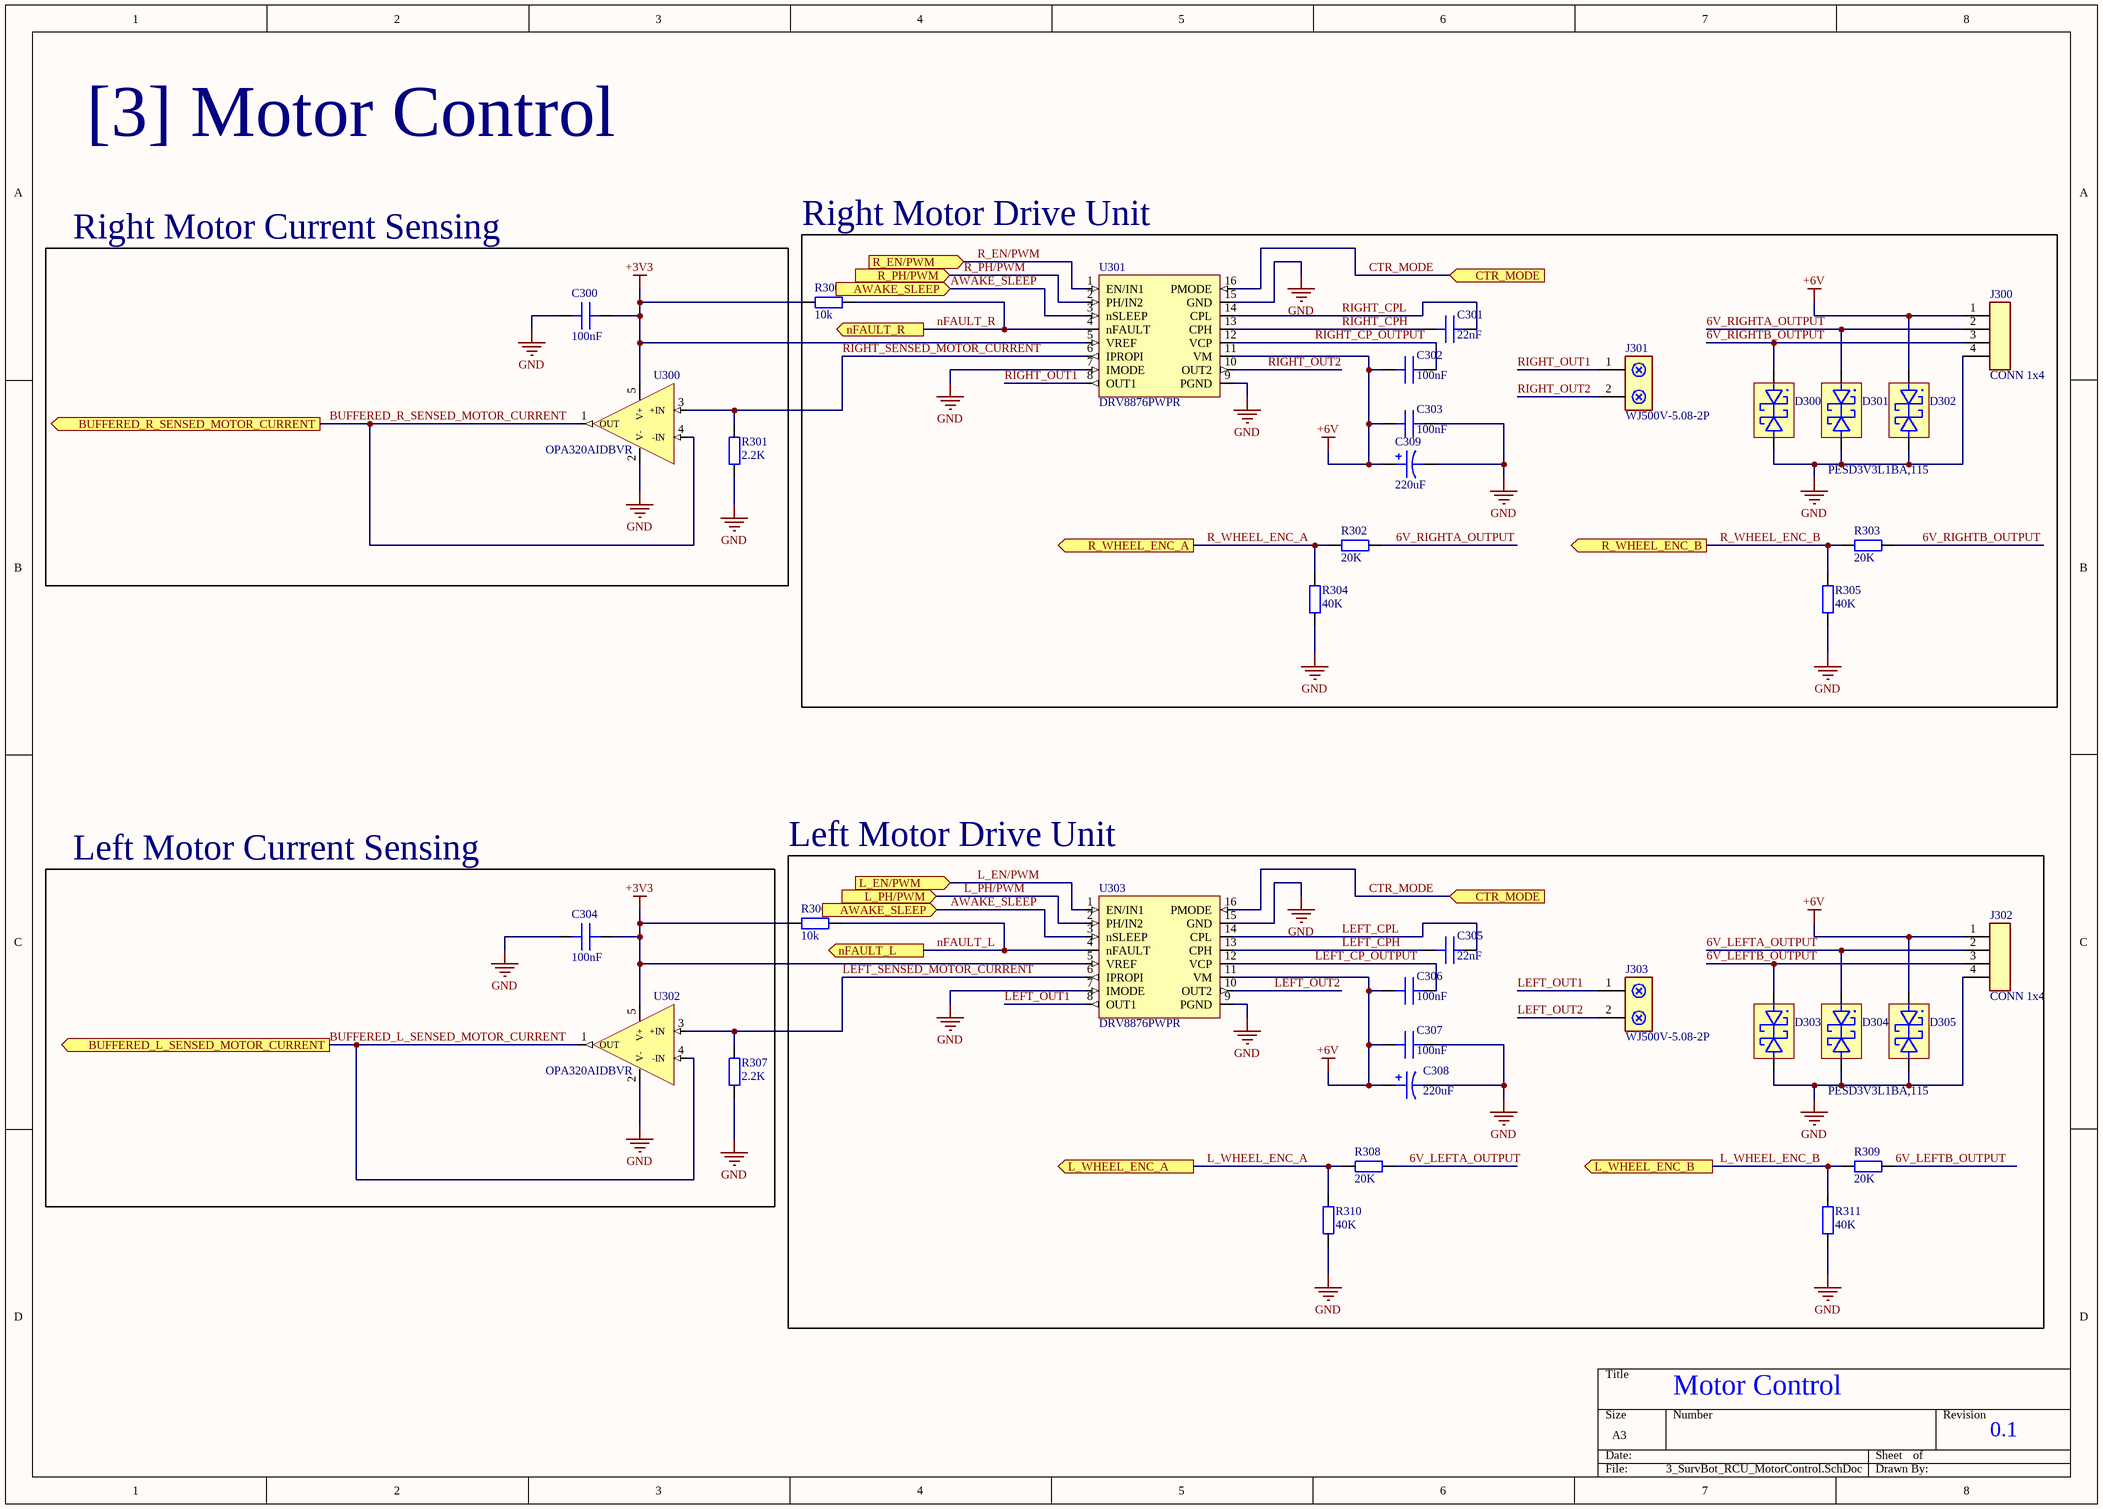
[diagram p3: 3_SurvBot_RCU_MotorControl.SchDoc]

### Parts
C300  100nF  [CAP_0603]
C301  22nF  [CAP_0603]
C302  100nF  [CAP_0603]
C303  100nF  [CAP_0603]
C304  100nF  [CAP_0603]
C305  22nF  [CAP_0603]
C306  100nF  [CAP_0603]
C307  100nF  [CAP_0603]
C308  220uF  [CAP-THT-Radial__D8.0mmP3.5mm]
C309  220uF  [CAP-THT-Radial__D8.0mmP3.5mm]
D300  PESD3V3L1BA,115  [SC-76, SOD-323]  (value not drawn)
D301  PESD3V3L1BA,115  [SC-76, SOD-323]  (value not drawn)
D302  PESD3V3L1BA,115  [SC-76, SOD-323]  (value not drawn)
D303  PESD3V3L1BA,115  [SC-76, SOD-323]  (value not drawn)
D304  PESD3V3L1BA,115  [SC-76, SOD-323]  (value not drawn)
D305  PESD3V3L1BA,115  [SC-76, SOD-323]  (value not drawn)
J300  CONN 1x4  [2541FV-4P]
J301  WJ500V-5.08-2P  [WJ500V-5.08-2P]
J302  CONN 1x4  [2541FV-4P]
J303  WJ500V-5.08-2P  [WJ500V-5.08-2P]
R300  10k  [RES_0402]
R301  2.2K  [RES_0603]
R302  20K  [RES_0603]
R303  20K  [RES_0603]
R304  40K  [RES_0603]
R305  40K  [RES_0603]
R306  10k  [RES_0402]
R307  2.2K  [RES_0603]
R308  20K  [RES_0603]
R309  20K  [RES_0603]
R310  40K  [RES_0603]
R311  40K  [RES_0603]
U300  OPA320AIDBVR  [SOT-23-5]
U301  DRV8876PWPR  [16-HTSSOP]
U302  OPA320AIDBVR  [SOT-23-5]
U303  DRV8876PWPR  [16-HTSSOP]

### Blocks framed on the sheet
Right Motor Drive Unit: C301-C303 C309 D300-D302 J300 J301 R300 R302-R305 U301
Right Motor Current Sensing: C300 R301 U300
Left Motor Current Sensing: C304 R307 U302
Left Motor Drive Unit: C305-C308 D303-D305 J302 J303 R306 R308-R311 U303

### Ports
AWAKE_SLEEP (in, see 0_SurvBot_RCU_Overview[3B], 2_SurvBot_RCU_MCU[4B]), BUFFERED_L_SENSED_MOTOR_CURRENT (out, see 0_SurvBot_RCU_Overview[4B], 6_SurvBot_RCU_CurrentFeedback[3C]), BUFFERED_R_SENSED_MOTOR_CURRENT (out, see 0_SurvBot_RCU_Overview[4B], 6_SurvBot_RCU_CurrentFeedback[3B]), CTR_MODE (in, see 0_SurvBot_RCU_Overview[3C], 2_SurvBot_RCU_MCU[4B]), L_EN/PWM (in, see 0_SurvBot_RCU_Overview[3B], 2_SurvBot_RCU_MCU[4A]), L_PH/PWM (in, see 0_SurvBot_RCU_Overview[3B], 2_SurvBot_RCU_MCU[3B]), L_WHEEL_ENC_A (out, see 0_SurvBot_RCU_Overview[3B], 2_SurvBot_RCU_MCU[3B]), L_WHEEL_ENC_B (out, see 0_SurvBot_RCU_Overview[3B], 2_SurvBot_RCU_MCU[3B]), nFAULT_L (out, see 0_SurvBot_RCU_Overview[3B], 2_SurvBot_RCU_MCU[4A]), nFAULT_R (out, see 0_SurvBot_RCU_Overview[3B], 2_SurvBot_RCU_MCU[4B]), R_EN/PWM (in, see 0_SurvBot_RCU_Overview[3B], 2_SurvBot_RCU_MCU[3B]), R_PH/PWM (in, see 0_SurvBot_RCU_Overview[3B], 2_SurvBot_RCU_MCU[3B]), R_WHEEL_ENC_A (out, see 0_SurvBot_RCU_Overview[3B], 2_SurvBot_RCU_MCU[3B]), R_WHEEL_ENC_B (out, see 0_SurvBot_RCU_Overview[3B], 2_SurvBot_RCU_MCU[3B])

### Nets
+3V3: C300.1 C304.1 R300.1 R306.1 U300.5(V+) U301.5(VREF) U302.5(V+) U303.5(VREF)
+6V: C302.2 C303.2 C306.2 C307.2 C308.1 C309.1 D302.K1 D305.K1 J300.1 J302.1 U301.11(VM) U303.11(VM)
GND: C300.2 C303.1 C304.2 C307.1 C308.2 C309.2 D300.K2 D301.K2 D302.K2 D303.K2 D304.K2 D305.K2 J300.4 J302.4 R301.1 R304.1 R305.1 R307.1 R310.1 R311.1 U300.2(V-) U301.7(IMODE) U301.9(PGND) U301.15(GND) U302.2(V-) U303.7(IMODE) U303.9(PGND) U303.15(GND)
6V_LEFTA_OUTPUT: D304.K1 J302.2 R308.2
6V_LEFTB_OUTPUT: D303.K1 J302.3 R309.2
6V_RIGHTA_OUTPUT: D301.K1 J300.2 R302.2
6V_RIGHTB_OUTPUT: D300.K1 J300.3 R303.2
AWAKE_SLEEP: U301.3(nSLEEP) U303.3(nSLEEP) ; port AWAKE_SLEEP
BUFFERED_L_SENSED_MOTOR_CURRENT: U302.1(OUT) U302.4(-IN) ; port BUFFERED_L_SENSED_MOTOR_CURRENT
BUFFERED_R_SENSED_MOTOR_CURRENT: U300.1(OUT) U300.4(-IN) ; port BUFFERED_R_SENSED_MOTOR_CURRENT
CTR_MODE: U301.16(PMODE) U303.16(PMODE) ; port CTR_MODE
L_EN/PWM: U303.1(EN/IN1) ; port L_EN/PWM
L_PH/PWM: U303.2(PH/IN2) ; port L_PH/PWM
L_WHEEL_ENC_A: R308.1 R310.2 ; port L_WHEEL_ENC_A
L_WHEEL_ENC_B: R309.1 R311.2 ; port L_WHEEL_ENC_B
LEFT_CP_OUTPUT: C306.1 U303.12(VCP)
LEFT_CPH: C305.1 U303.13(CPH)
LEFT_CPL: C305.2 U303.14(CPL)
LEFT_OUT1: J303.1 U303.8(OUT1)
LEFT_OUT2: J303.2 U303.10(OUT2)
LEFT_SENSED_MOTOR_CURRENT: R307.2 U302.3(+IN) U303.6(IPROPI)
nFAULT_L: R306.2 U303.4(nFAULT) ; port nFAULT_L
nFAULT_R: R300.2 U301.4(nFAULT) ; port nFAULT_R
R_EN/PWM: U301.1(EN/IN1) ; port R_EN/PWM
R_PH/PWM: U301.2(PH/IN2) ; port R_PH/PWM
R_WHEEL_ENC_A: R302.1 R304.2 ; port R_WHEEL_ENC_A
R_WHEEL_ENC_B: R303.1 R305.2 ; port R_WHEEL_ENC_B
RIGHT_CP_OUTPUT: C302.1 U301.12(VCP)
RIGHT_CPH: C301.1 U301.13(CPH)
RIGHT_CPL: C301.2 U301.14(CPL)
RIGHT_OUT1: J301.1 U301.8(OUT1)
RIGHT_OUT2: J301.2 U301.10(OUT2)
RIGHT_SENSED_MOTOR_CURRENT: R301.2 U300.3(+IN) U301.6(IPROPI)

### Notes on the sheet
- [3] Motor Control
- PESD3V3L1BA,115
- Motor Control
- 0.1

### Library data of the parts
C300 C302-C304 C306 C307 = CAP_100nF-50V-10%-0603: as C103 on sheet 1_SurvBot_RCU_Power; Case/Package: 0603; Supplier: JLCPCB; Supplier Part #: C129621
C301 C305 = CAP_22nF_100V-10%-0603: 0.022 µF ±10% 100V Ceramic Capacitor X7R 0603 (1608 Metric); Manufacturer: Murata Electronics; Manufacturer Part #: GCM188R72A223KA37D; Case/Package: 0603; Supplier: JLCPCB; Supplier Part #: C161234
C308 C309 = CAP_220uF-35V-20%_RADIAL-TH: 220 µF 35 V Aluminum Electrolytic Capacitors Radial, Can 8000 Hrs @ 105°C; Manufacturer: Rubycon; Manufacturer Part #: 35ZLH220MEFC8X11.5; Case/Package: TH,D8xL11.5mm; Supplier: JLCPCB; Supplier Part #: C107639
D300-D305 = DIO-TVS_3.3V-26V-18A-SOD-323: as D200 on sheet 2_SurvBot_RCU_MCU; Manufacturer Part #: PESD3V3L1BA,115; Case/Package: SOD-323; Supplier: JLCPCB; Supplier Part #: C51450
J300 J302 = CONN_4_HDR_0.1-2541FV-4P: 2.54mm 3A Single Row 4P -40℃~+105℃ 250V Direct Insert 1x4P Top Square Hole Plugin,P=2.54mm Female Headers ROHS; Manufacturer: HanElectricity; Manufacturer Part #: 2541FV-4P; Case/Package: P=2.54mm; Supplier: JLCPCB; Supplier Part #: C18723049
J301 J303 = Terminal_Screw_5.08mm_2P: 1x2P 5.08mm 2.5 1 2 18A -40℃~+105℃ 250V Green 14~30 Direct Insert Plugin,P=5.08mm Screw Terminal Blocks ROHS; Manufacturer: Ningbo Kangnex Elec; Manufacturer Part #: WJ500V-5.08-2P; Case/Package: P=5.08mm; Supplier: JLCPCB; Supplier Part #: C8465
R300 R306 = RES_10K-62.5mW-1%-0402: as R201 on sheet 2_SurvBot_RCU_MCU; Case/Package: 0402; Supplier: JLCPCB; Supplier Part #: C60490
R301 R307 = RES_2.2K-100mW-1%-0603: 2.2 kOhms ±1% 0.1W, 1/10W Chip Resistor 0603 (1608 Metric) Moisture Resistant Thick Film; Manufacturer: YAGEO; Manufacturer Part #: RC0603FR-072K2L; Case/Package: 0603; Supplier: JLCPCB; Supplier Part #: C114662
R302 R303 R308 R309 = RES_20K-100mW-1%-0603: 20 kOhms ±1% 0.1W, 1/10W Chip Resistor 0603 (1608 Metric) Automotive AEC-Q200 Thick Film; Manufacturer: PANASONIC; Manufacturer Part #: ERJ-3EKF2002V; Case/Package: 0603; Supplier: JLCPCB; Supplier Part #: C403057
R304 R305 R310 R311 = RES_40K_100mW-1%-0603: 40 kOhms ±0.1% 0.1W, 1/10W Chip Resistor 0603 (1608 Metric) Anti-Sulfur, Automotive AEC-Q200, Moisture Resistant Thin Film; Manufacturer: YAGEO; Manufacturer Part #: AT0603BRD0740KL; Case/Package: 0603; Supplier: JLCPCB; Supplier Part #: C5455515
U300 U302 = OPAMP-OPA320_R2R_SOT23-5: General Purpose Amplifier 1 Circuit Rail-to-Rail SOT-23-5; Manufacturer: Texas Instruments; Manufacturer Part #: OPA320AIDBVR; Case/Package: SOT-23-5; Supplier: JLCPCB; Supplier Part #: C92494
U301 U303 = MTRDRV-DRV8876-HBridge_4.5-37V_3.5A: DRV8876 H-Bridge Motor Driver With Integrated Current Sense and Regulation 16-HTSSOP; Manufacturer: Texas Instruments; Manufacturer Part #: DRV8876PWPR; Case/Package: HTSSOP-16-EP; Supplier: JLCPCB; Supplier Part #: C575551

## Sheet 6_SurvBot_RCU_CurrentFeedback.SchDoc
size A4; SheetNumber: 7; SheetTotal: 8
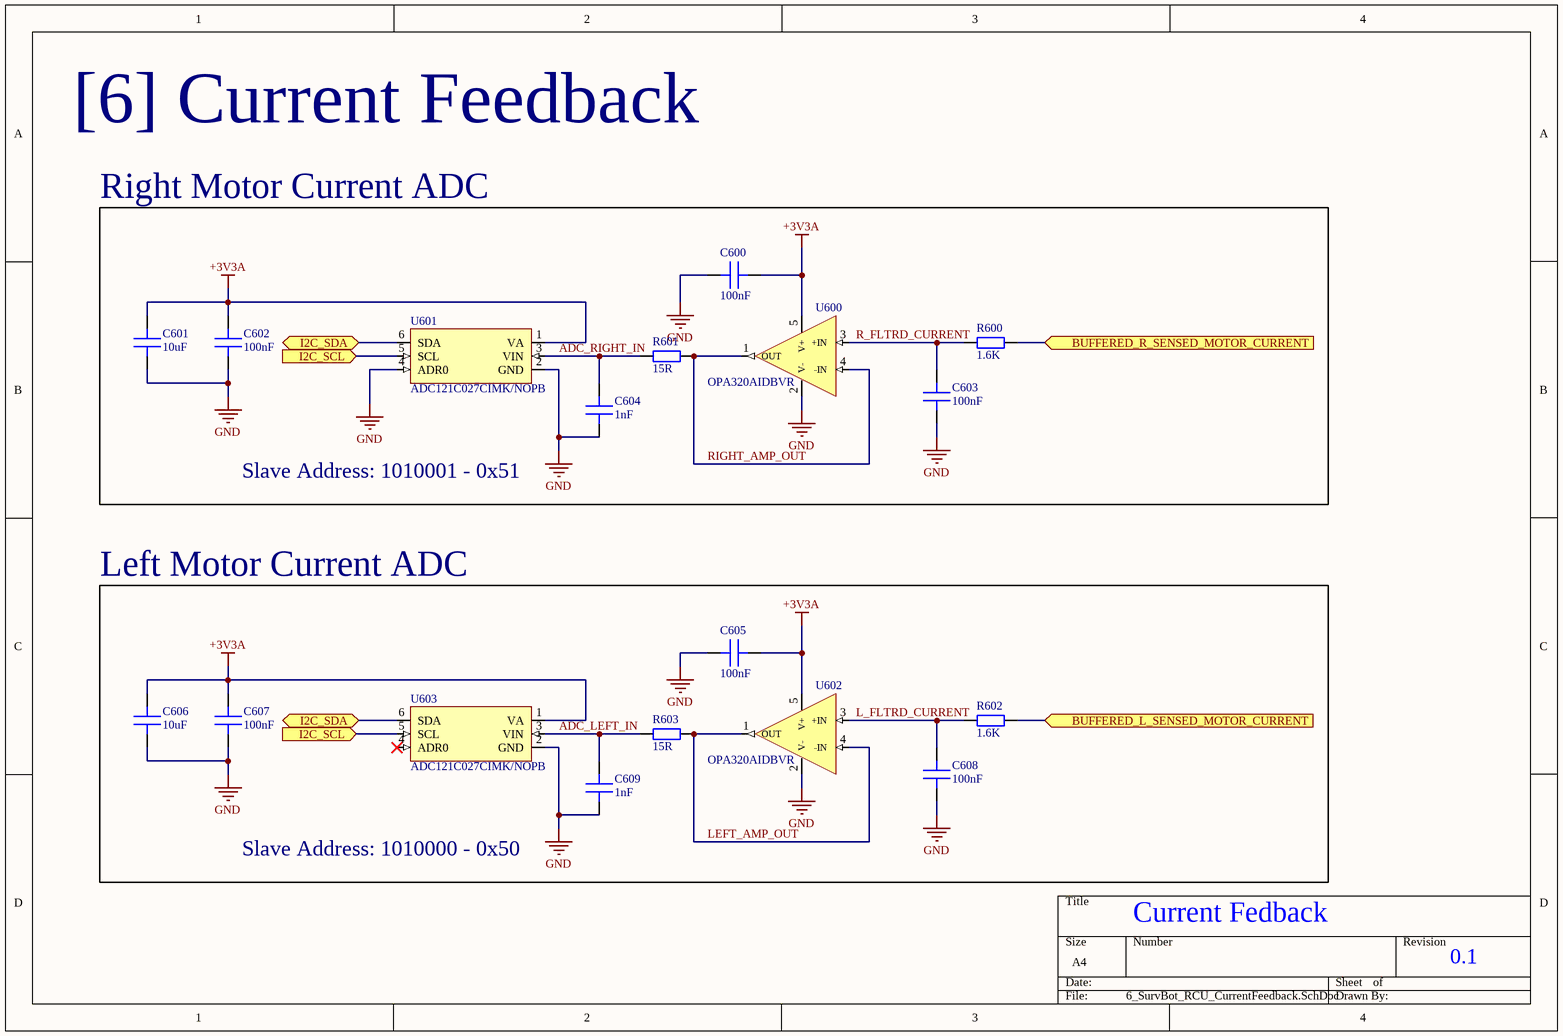
[diagram p4: 6_SurvBot_RCU_CurrentFeedback.SchDoc]

### Parts
C600  100nF  [CAP_0402]
C601  10uF  [CAP_0402]
C602  100nF  [CAP_0402]
C603  100nF  [CAP_0603]
C604  1nF  [CAP_0402]
C605  100nF  [CAP_0402]
C606  10uF  [CAP_0402]
C607  100nF  [CAP_0402]
C608  100nF  [CAP_0603]
C609  1nF  [CAP_0402]
R600  1.6K  [RES_0603]
R601  15R  [RES_0603]
R602  1.6K  [RES_0603]
R603  15R  [RES_0603]
U600  OPA320AIDBVR  [SOT-23-5]
U601  ADC121C027CIMK/NOPB  [SOT-23-6 Thin, TSOT-23-6]
U602  OPA320AIDBVR  [SOT-23-5]
U603  ADC121C027CIMK/NOPB  [SOT-23-6 Thin, TSOT-23-6]

### Blocks framed on the sheet
Right Motor Current ADC: C600-C604 R600 R601 U600 U601
Left Motor Current ADC: C605-C609 R602 R603 U602 U603

### Ports
BUFFERED_L_SENSED_MOTOR_CURRENT (in, see 0_SurvBot_RCU_Overview[4D], 3_SurvBot_RCU_MotorControl[1C]), BUFFERED_R_SENSED_MOTOR_CURRENT (in, see 0_SurvBot_RCU_Overview[4D], 3_SurvBot_RCU_MotorControl[1B]), I2C_SCL (in, see 0_SurvBot_RCU_Overview[3C], 2_SurvBot_RCU_MCU[2B], 5_SurvBot_RCU_Sensors[1B], 5_SurvBot_RCU_Sensors[2D], 5_SurvBot_RCU_Sensors[3B]), I2C_SDA (bidir, see 0_SurvBot_RCU_Overview[3D], 2_SurvBot_RCU_MCU[2B], 5_SurvBot_RCU_Sensors[1B], 5_SurvBot_RCU_Sensors[2C], 5_SurvBot_RCU_Sensors[3B])

### Nets
+3V3A: C600.2 C601.2 C602.2 C605.2 C606.2 C607.2 U600.5(V+) U601.1(VA) U602.5(V+) U603.1(VA)
GND: C600.1 C601.1 C602.1 C603.1 C604.1 C605.1 C606.1 C607.1 C608.1 C609.1 U600.2(V-) U601.2(GND) U601.4(ADR0) U602.2(V-) U603.2(GND)
ADC_LEFT_IN: C609.2 R603.1 U603.3(VIN)
ADC_RIGHT_IN: C604.2 R601.1 U601.3(VIN)
BUFFERED_L_SENSED_MOTOR_CURRENT: R602.2 ; port BUFFERED_L_SENSED_MOTOR_CURRENT
BUFFERED_R_SENSED_MOTOR_CURRENT: R600.2 ; port BUFFERED_R_SENSED_MOTOR_CURRENT
I2C_SCL: U601.5(SCL) U603.5(SCL) ; port I2C_SCL
I2C_SDA: U601.6(SDA) U603.6(SDA) ; port I2C_SDA
L_FLTRD_CURRENT: C608.2 R602.1 U602.3(+IN)
LEFT_AMP_OUT: R603.2 U602.1(OUT) U602.4(-IN)
R_FLTRD_CURRENT: C603.2 R600.1 U600.3(+IN)
RIGHT_AMP_OUT: R601.2 U600.1(OUT) U600.4(-IN)

Not connected (* = marked no-connect by the designer): U603 4(ADR0)*

### Notes on the sheet
- [6] Current Feedback
- Slave Address: 1010001 - 0x51
- Slave Address: 1010000 - 0x50
- Current Fedback
- 0.1

### Library data of the parts
C600 C602 C605 C607 = CAP_100nF-10V-10%-0402: as C201 on sheet 2_SurvBot_RCU_MCU; Case/Package: 0402; Supplier: JLCPCB; Supplier Part #: C133086
C601 C606 = CAP_10uF-10V-20%-0402: 10 µF ±20% 10V Ceramic Capacitor X5R 0402 (1005 Metric); Manufacturer: Murata Electronics; Manufacturer Part #: GRM155R61A106ME11D; Case/Package: 0402; Supplier: JLCPCB; Supplier Part #: C408132
C603 C608 = CAP_100nF-50V-10%-0603: as C103 on sheet 1_SurvBot_RCU_Power; Case/Package: 0603; Supplier: JLCPCB; Supplier Part #: C129621
C604 C609 = CAP_1nF-50V-5%-0402: 1000 pF ±5% 50V Ceramic Capacitor C0G, NP0 0402 (1005 Metric); Manufacturer: Murata Electronics; Manufacturer Part #: GRM1555C1H102JA01D; Case/Package: 0402; Supplier: JLCPCB; Supplier Part #: C76947
R600 R602 = RES_1.6K-100mW-1%-0603: 1.6 kOhms ±1% 0.1W, 1/10W Chip Resistor 0603 (1608 Metric) Moisture Resistant Thick Film; Manufacturer: BOURNS; Manufacturer Part #: CR0603-FX-1601ELF; Case/Package: 0603; Supplier: JLCPCB; Supplier Part #: C203329
R601 R603 = RES_15R-100mW-1%-0603: 15 Ohms ±1% 0.1W, 1/10W Chip Resistor 0603 (1608 Metric) Automotive AEC-Q200 Thick Film; Manufacturer: PANASONIC; Manufacturer Part #: ERJ3EKF15R0V; Case/Package: 0603; Supplier: JLCPCB; Supplier Part #: C403005
U600 U602 = OPAMP-OPA320_R2R_SOT23-5: as U300 on sheet 3_SurvBot_RCU_MotorControl; Manufacturer Part #: OPA320AIDBVR; Case/Package: SOT-23-5; Supplier: JLCPCB; Supplier Part #: C92494
U601 U603 = IC_ADC121C027CIMK/NOPB: 12 Bit Analog to Digital Converter 1 Input 1 SAR TSOT-23-6; Manufacturer: Texas Instruments; Manufacturer Part #: ADC121C027CIMK/NOPB; Case/Package: TSOT-23-6L; Supplier: JLCPCB; Supplier Part #: C201638

## Sheet 5_SurvBot_RCU_Sensors.SchDoc
size A4; SheetNumber: 6; SheetTotal: 8
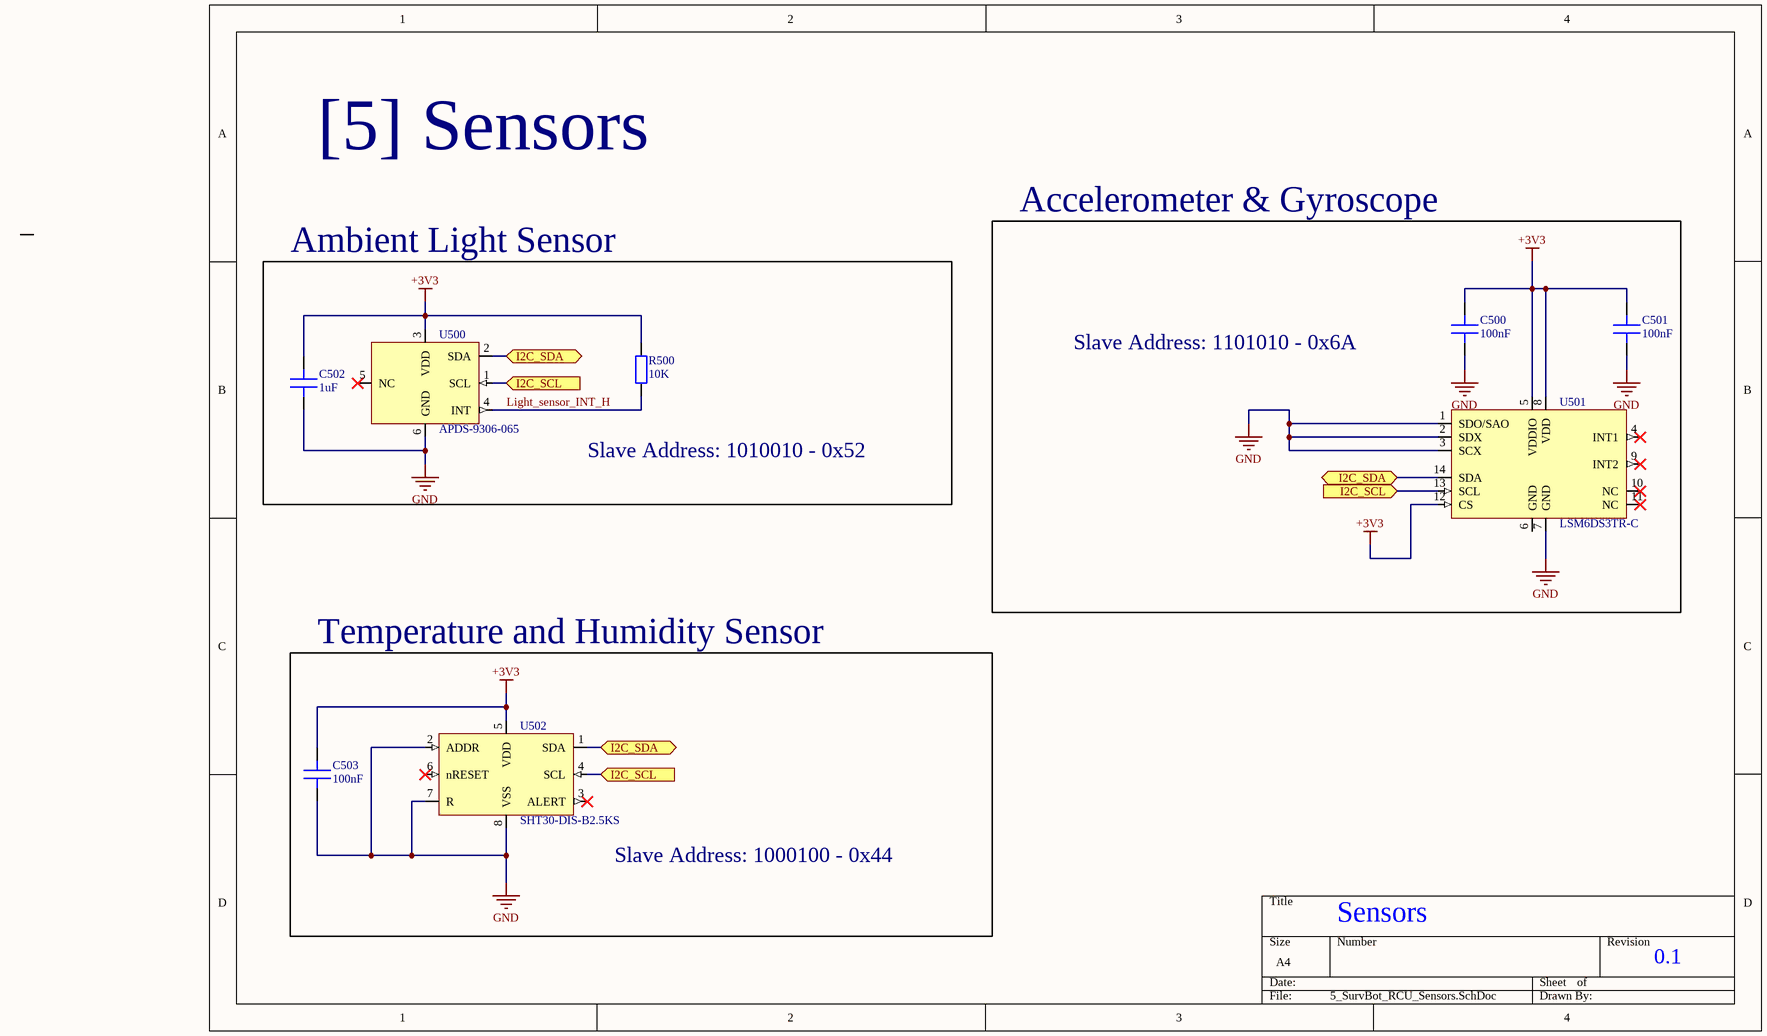
[diagram p5: 5_SurvBot_RCU_Sensors.SchDoc]

### Parts
C500  100nF  [CAP_0603]
C501  100nF  [CAP_0603]
C502  1uF  [CAP_0603]
C503  100nF  [CAP_0603]
R500  10K  [RES_0603]
U500  APDS-9306-065  [APDS-9306-065]
U501  LSM6DS3TR-C  [LGA-14_LSM6DS3TR-C]
U502  SHT30-DIS-B2.5KS  [8-VFDFN Exposed Pad]

### Blocks framed on the sheet
Accelerometer & Gyroscope: C500 C501 U501
Ambient Light Sensor: C502 R500 U500
Temperature and Humidity Sensor: C503 U502

### Ports
I2C_SCL (in, see 0_SurvBot_RCU_Overview[3C], 2_SurvBot_RCU_MCU[2B], 6_SurvBot_RCU_CurrentFeedback[1B], 6_SurvBot_RCU_CurrentFeedback[1C]), I2C_SDA (bidir, see 0_SurvBot_RCU_Overview[3C], 2_SurvBot_RCU_MCU[2B], 6_SurvBot_RCU_CurrentFeedback[1B], 6_SurvBot_RCU_CurrentFeedback[1C])

### Nets
+3V3: C500.2 C501.2 C502.2 C503.2 R500.2 U500.3(VDD) U501.5(VDDIO) U501.8(VDD) U501.12(CS) U502.5(VDD)
GND: C500.1 C501.1 C502.1 C503.1 U500.6(GND) U501.1(SDO/SAO) U501.2(SDX) U501.3(SCX) U501.7(GND) U502.2(ADDR) U502.7(R) U502.8(VSS)
I2C_SCL: U500.1(SCL) U501.13(SCL) U502.4(SCL) ; port I2C_SCL
I2C_SDA: U500.2(SDA) U501.14(SDA) U502.1(SDA) ; port I2C_SDA
Light_sensor_INT_H: R500.1 U500.4(INT)

Not connected (* = marked no-connect by the designer): U500 5(NC)*; U501 4(INT1)* 6(GND) 9(INT2)* 10(NC)* 11(NC)*; U502 3(ALERT)* 6(nRESET)*

### Notes on the sheet
- [5] Sensors
- Slave Address: 1101010 - 0x6A
- Slave Address: 1010010 - 0x52
- (near U502) Slave Address: 1000100 - 0x44
- Sensors
- 0.1

### Library data of the parts
C500 C501 C503 = CAP_100nF-50V-10%-0603: as C103 on sheet 1_SurvBot_RCU_Power; Case/Package: 0603; Supplier: JLCPCB; Supplier Part #: C129621
C502 = CAP_1uF-16V-10%-0603: as C107 on sheet 1_SurvBot_RCU_Power; Case/Package: 0603; Supplier: JLCPCB; Supplier Part #: C106248
R500 = RES_10K-100mW-1%-0603: 10 kOhms ±1% 0.1W, 1/10W Chip Resistor 0603 (1608 Metric) Moisture Resistant Thick Film; Manufacturer: YAGEO; Manufacturer Part #: RC0603FR-0710KL; Case/Package: 0603; Supplier: JLCPCB; Supplier Part #: C98220
U500 = IC_APDS-9306-065: Optical Sensor Ambient 560nm I2C 6-SMD Module; Manufacturer: Broadcom/AVAGO; Manufacturer Part #: APDS-9306-065; Case/Package: 6-SMD Module; Supplier: JLCPCB; Supplier Part #: C2649498
U501 = IC_LSM6DS3TR-C: Accelerometer, Gyroscope, Temperature, 6 Axis Sensor I2C, SPI Output; Manufacturer: STMicroelectronics; Manufacturer Part #: LSM6DS3TR-C; Case/Package: LGA-14(2.5x3); Supplier: JLCPCB; Supplier Part #: C967633
U502 = IC_SHT30-DIS-B2.5KS: Humidity, Temperature 0 ~ 100% RH I2C ±2% RH 8 s Surface Mount; Manufacturer: Sensirion; Manufacturer Part #: SHT30-DIS-B2.5KS; Case/Package: 8-VFDFN Exposed Pad; Supplier: JLCPCB; Supplier Part #: C77361

## Sheet 4_SurvBot_RCU_Bluetooth.SchDoc
size A2; SheetNumber: 5; SheetTotal: 8
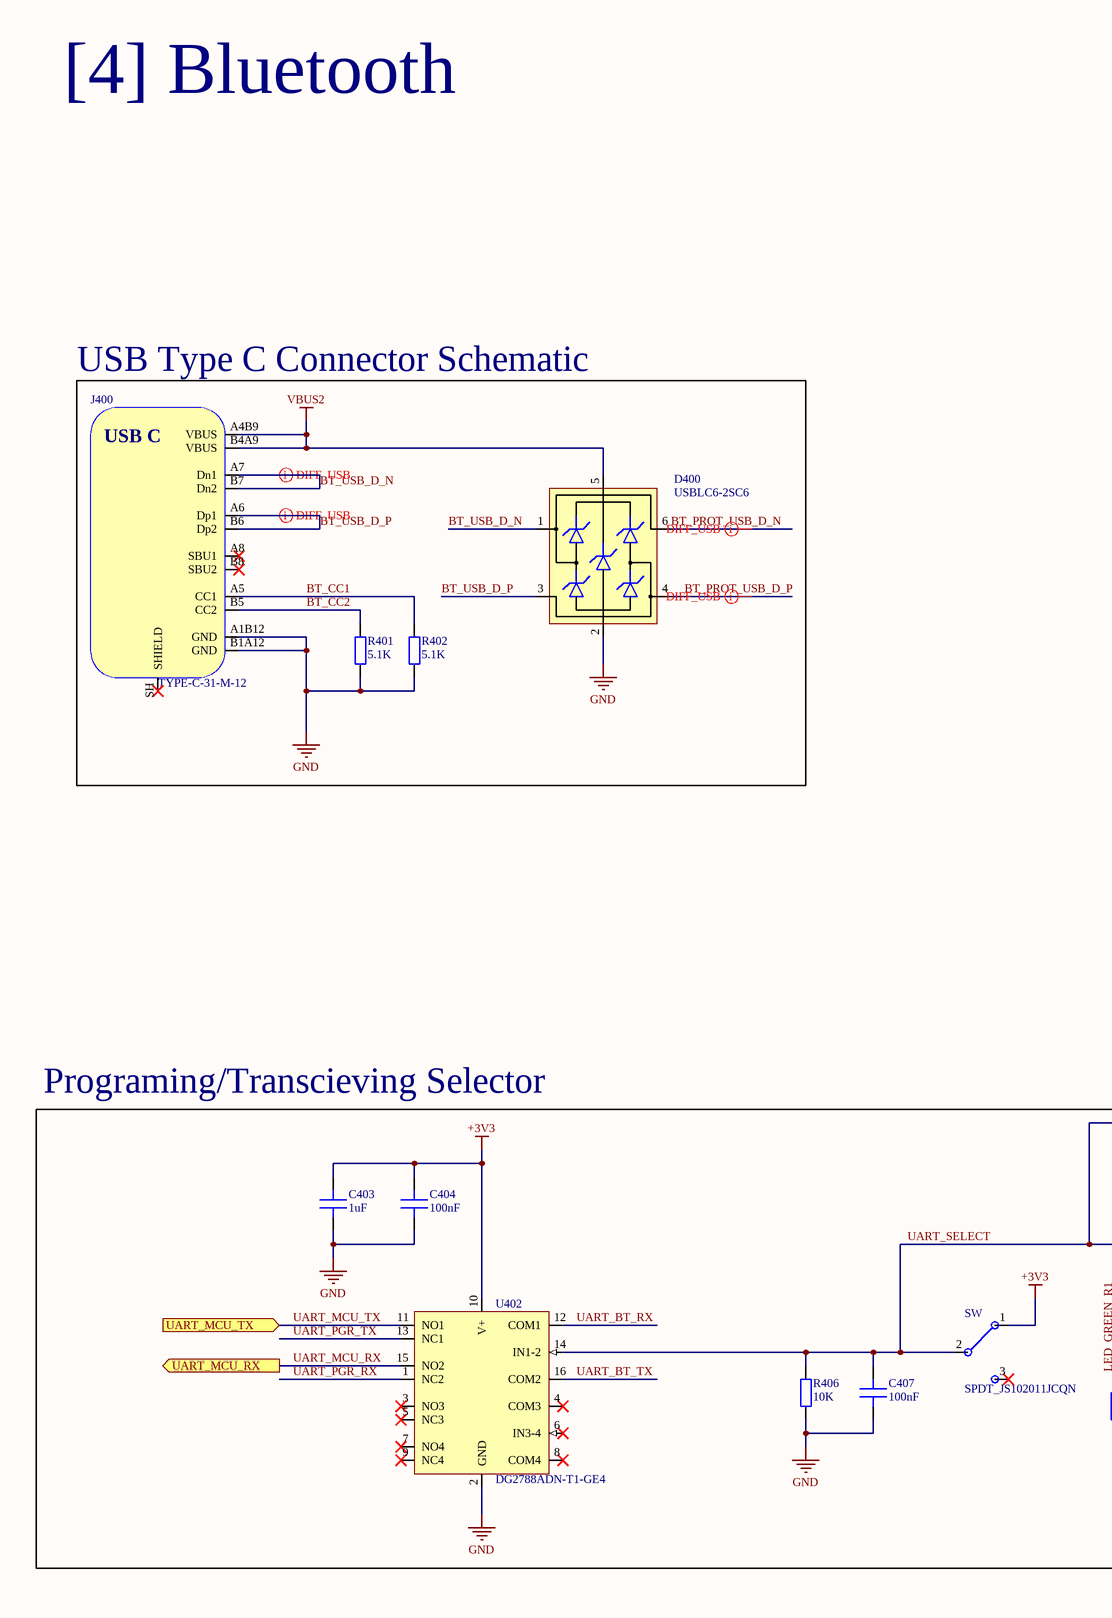
[diagram p6: 4_SurvBot_RCU_Bluetooth.SchDoc, left]
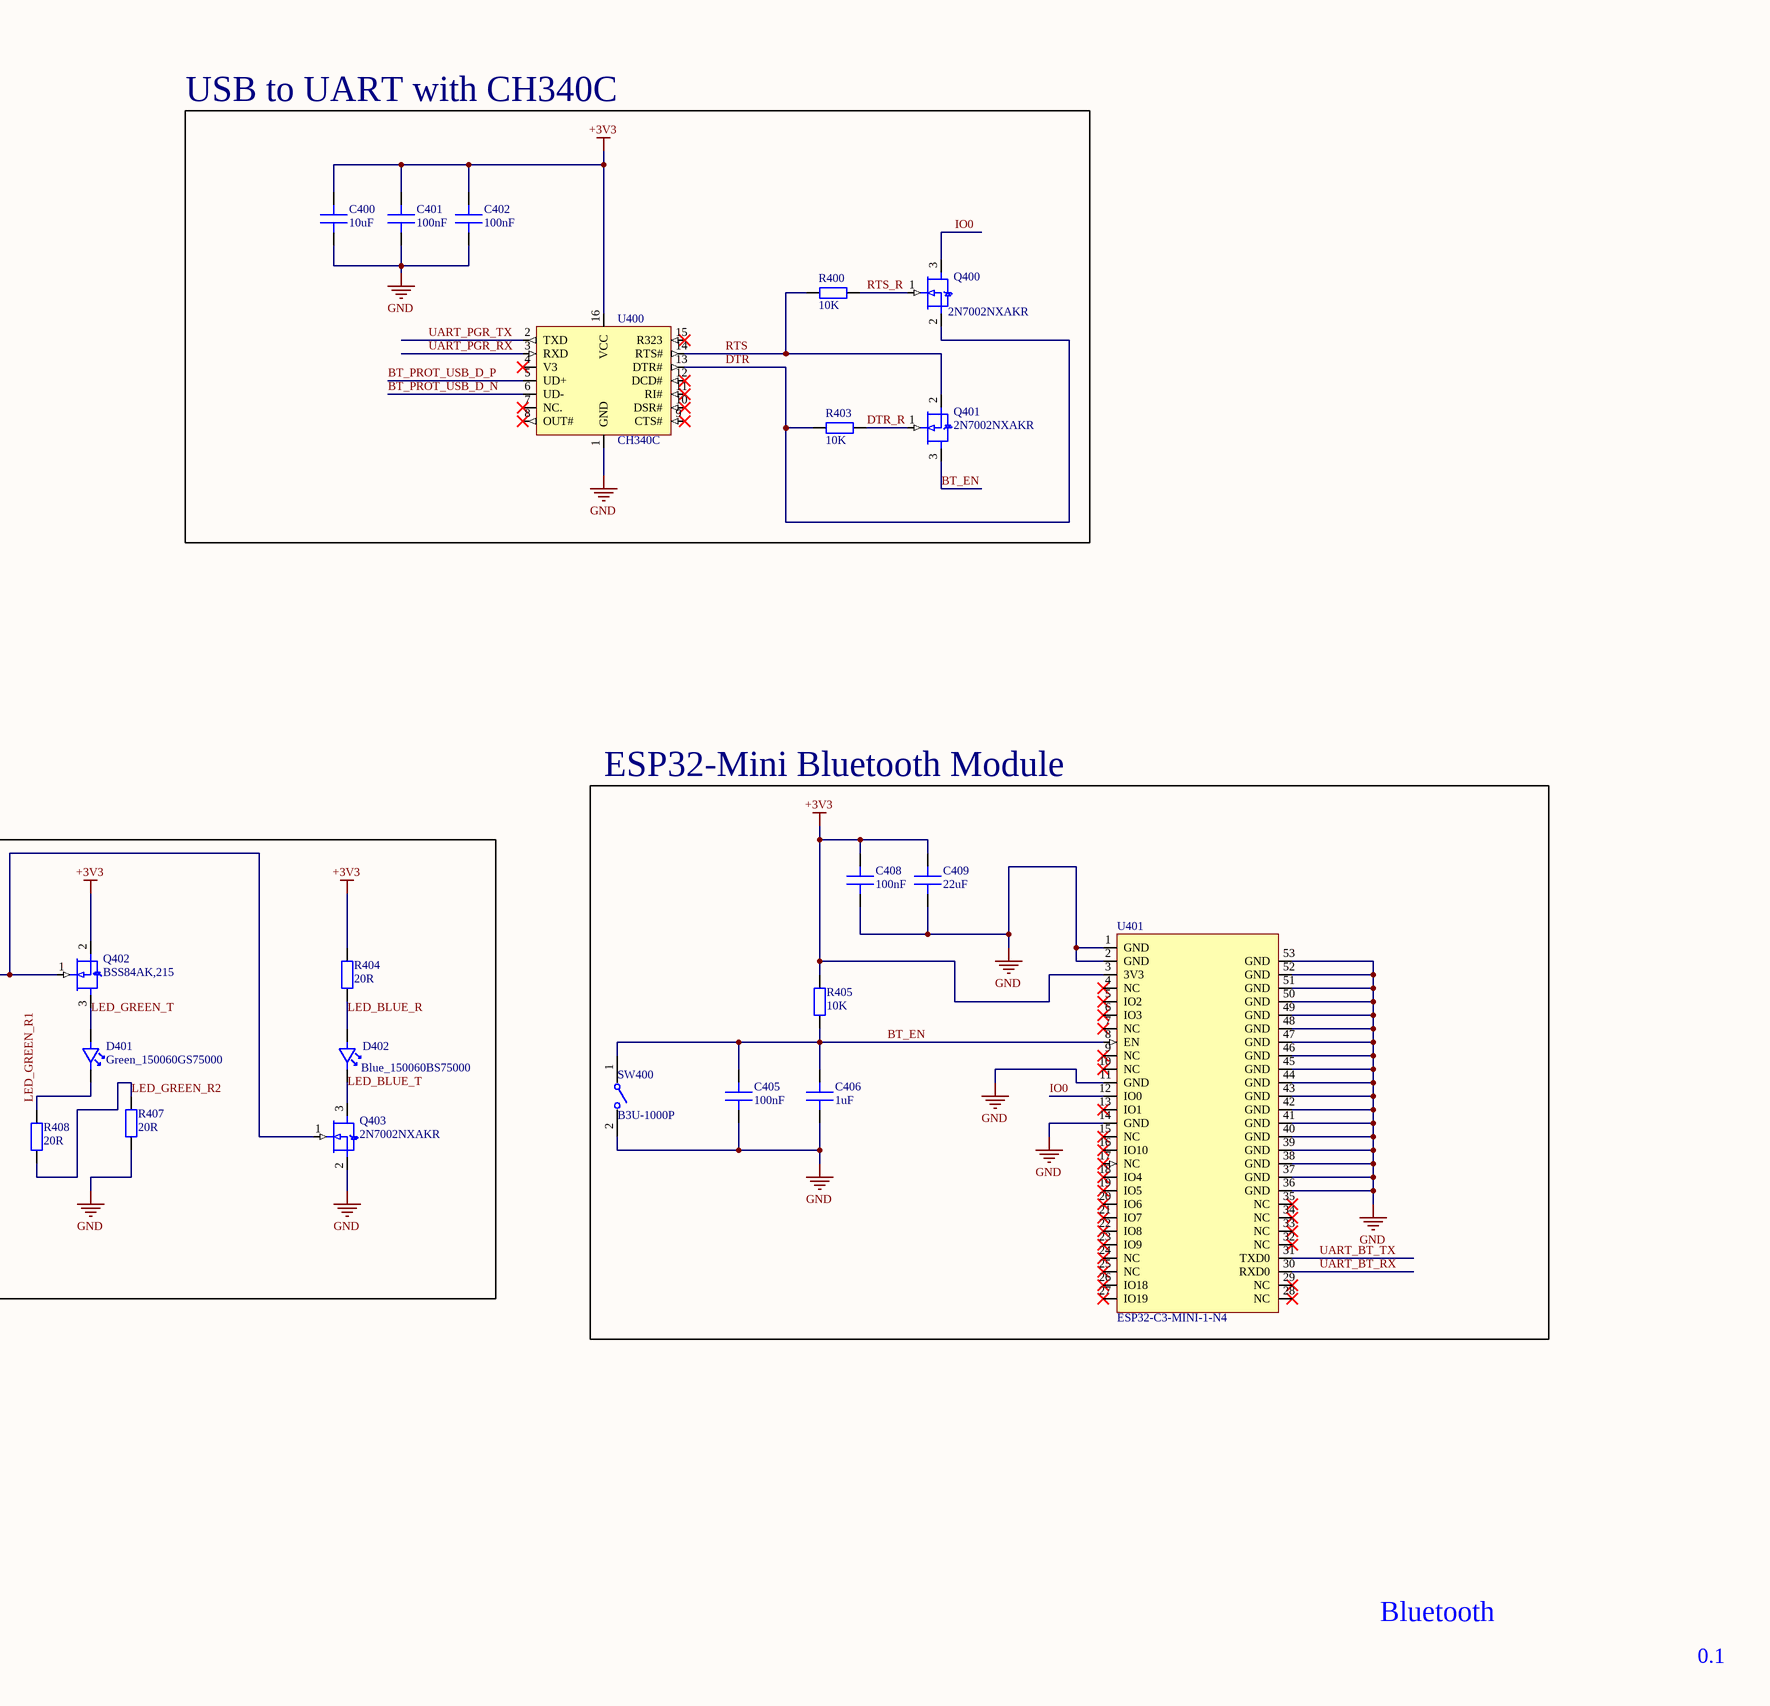
[diagram p7: 4_SurvBot_RCU_Bluetooth.SchDoc, right]

### Parts
C400  10uF  [CAP_0603]
C401  100nF  [CAP_0603]
C402  100nF  [CAP_0603]
C403  1uF  [CAP_0603]
C404  100nF  [CAP_0603]
C405  100nF  [CAP_0603]
C406  1uF  [CAP_0603]
C407  100nF  [CAP_0603]
C408  100nF  [CAP_0603]
C409  22uF  [CAP_0603]
D400  USBLC6-2SC6  [SOT-23-6]
D401  Green_150060GS75000  [LED_0603]
D402  Blue_150060BS75000  [LED_0603]
J400  TYPE-C-31-M-12  [USB4105-GF-A-060]
Q400  2N7002NXAKR  [SOT23-3]
Q401  2N7002NXAKR  [SOT23-3]
Q402  BSS84AK,215  [SOT23-3]
Q403  2N7002NXAKR  [SOT23-3]
R400  10K  [RES_0603]
R401  5.1K  [RES_0603]
R402  5.1K  [RES_0603]
R403  10K  [RES_0603]
R404  20R  [RES_0603]
R405  10K  [RES_0603]
R406  10K  [RES_0603]
R407  20R  [RES_0603]
R408  20R  [RES_0603]
SW  SPDT_JS102011JCQN  [SPDT_Slide-JS102011JCQN]
SW400  B3U-1000P  [FP-B3U-1000P-MFG]
U400  CH340C  [SOP-16]
U401  ESP32-C3-MINI-1-N4  [ESP32­C3­MINI­1]
U402  DG2788ADN-T1-GE4  [UQFN-16-DG2788ADN-T1-GE4]

### Blocks framed on the sheet
USB Type C Connector Schematic: D400 J400 R401 R402
USB to UART with CH340C: C400-C402 Q400 Q401 R400 R403 U400
ESP32-Mini Bluetooth Module: C405 C406 C408 C409 R405 SW400 U401
Programing/Transcieving Selector: C403 C404 C407 D401 D402 Q402 Q403 R404 R406-R408 SW U402

### Ports
UART_MCU_RX (out, see 0_SurvBot_RCU_Overview[1C], 2_SurvBot_RCU_MCU[4B]), UART_MCU_TX (in, see 0_SurvBot_RCU_Overview[1C], 2_SurvBot_RCU_MCU[4B])

### Nets
+3V3: C400.2 C401.2 C402.2 C403.2 C404.2 C408.2 C409.2 Q402.2(S) R404.1 R405.2 SW.1 U400.16(VCC) U401.3(3V3) U402.10(V+)
GND: C400.1 C401.1 C402.1 C403.1 C404.1 C405.1 C406.1 C407.1 C408.1 C409.1 D400.2(GND) J400.A1B12(GND) J400.B1A12(GND) Q403.2(S) R401.1 R402.1 R406.1 R407.1 SW400.2 U400.1(GND) U401.1(GND) U401.2(GND) U401.11(GND) U401.14(GND) U401.36(GND) U401.37(GND) U401.38(GND) U401.39(GND) U401.40(GND) U401.41(GND) U401.42(GND) U401.43(GND) U401.44(GND) U401.45(GND) U401.46(GND) U401.47(GND) U401.48(GND) U401.49(GND) U401.50(GND) U401.51(GND) U401.52(GND) U401.53(GND) U402.2(GND)
VBUS2: D400.5(VBUS) J400.A4B9(VBUS) J400.B4A9(VBUS)
BT_CC1: J400.A5(CC1) R402.2
BT_CC2: J400.B5(CC2) R401.2
BT_EN: C405.2 C406.2 Q401.3(D) R405.1 SW400.1 U401.8(EN)
BT_PROT_USB_D_N: D400.6(IO1) U400.6(UD-)
BT_PROT_USB_D_P: D400.4(IO2) U400.5(UD+)
BT_USB_D_N: D400.1(IO1) J400.A7(Dn1) J400.B7(Dn2)
BT_USB_D_P: D400.3(IO2) J400.A6(Dp1) J400.B6(Dp2)
DTR: Q400.2(S) R403.1 U400.13(DTR#)
DTR_R: Q401.1(G) R403.2
IO0: Q400.3(D) U401.12(IO0)
LED_BLUE_R: D402.2 R404.2
LED_BLUE_T: D402.1 Q403.3(D)
LED_GREEN_R1: D401.1 R408.1
LED_GREEN_R2: R407.2 R408.2
LED_GREEN_T: D401.2 Q402.3(D)
RTS: Q401.2(S) R400.1 U400.14(RTS#)
RTS_R: Q400.1(G) R400.2
UART_BT_RX: U401.30(RXD0) U402.12(COM1)
UART_BT_TX: U401.31(TXD0) U402.16(COM2)
UART_MCU_RX: U402.15(NO2) ; port UART_MCU_RX
UART_MCU_TX: U402.11(NO1) ; port UART_MCU_TX
UART_PGR_RX: U400.3(RXD) U402.1(NC2)
UART_PGR_TX: U400.2(TXD) U402.13(NC1)
UART_SELECT: C407.2 Q402.1(G) Q403.1(G) R406.2 SW.2 U402.14(IN1-2)

Not connected (* = marked no-connect by the designer): J400 A8(SBU1)* B8(SBU2)* SH(SHIELD)*; SW 3*; U400 4(V3)* 7(NC.)* 8(OUT#)* 9(CTS#)* 10(DSR#)* 11(RI#)* 12(DCD#)* 15(R323)*; U401 4(NC)* 5(IO2)* 6(IO3)* 7(NC)* 9(NC)* 10(NC)* 13(IO1)* 15(NC)* 16(IO10)* 17(NC)* 18(IO4)* 19(IO5)* 20(IO6)* 21(IO7)* 22(IO8)* 23(IO9)* 24(NC)* 25(NC)* 26(IO18)* 27(IO19)* 28(NC)* 29(NC)* 32(NC)* 33(NC)* 34(NC)* 35(NC)*; U402 3(NO3)* 4(COM3)* 5(NC3)* 6(IN3-4)* 7(NO4)* 8(COM4)* 9(NC4)*

### Layout directives
differential pair; differential pair class USB: BT_PROT_USB_D_N, BT_PROT_USB_D_P, BT_USB_D_N, BT_USB_D_P

### Notes on the sheet
- [4] Bluetooth
- Bluetooth
- 0.1
- (in symbol USB4105-GF-A-060_1) USB C

### Library data of the parts
C400 = CAP_10uF-10V-20%-0603: 10 µF ±20% 10V Ceramic Capacitor X5R 0603 (1608 Metric); Manufacturer: Murata Electronics; Manufacturer Part #: GRM188R61A106ME69D; Case/Package: 0603; Supplier: JLCPCB; Supplier Part #: C90053
C401 C402 C404 C405 C407 C408 = CAP_100nF-50V-10%-0603: as C103 on sheet 1_SurvBot_RCU_Power; Case/Package: 0603; Supplier: JLCPCB; Supplier Part #: C129621
C403 C406 = CAP_1uF-16V-10%-0603: as C107 on sheet 1_SurvBot_RCU_Power; Case/Package: 0603; Supplier: JLCPCB; Supplier Part #: C106248
C409 = CAP_22uF-10V-20%-0603: as C104 on sheet 1_SurvBot_RCU_Power; Case/Package: 0603; Supplier: JLCPCB; Supplier Part #: C86295
D400 = USBLC6-2SC6: as D201 on sheet 2_SurvBot_RCU_MCU; Manufacturer Part Number: USBLC6-2SC6; Distributor Link: https://www.mouser.de/ProductDetail/STMicroelectronics/USBLC6-2SC6?qs=po45yt2pPpu%2FhNIlwQdTlg%3D%3D
D401 = LED_Green-0603: Green 520nm LED Indication - Discrete 3.2V 0603 (1608 Metric); Manufacturer: Wurth Elektronik; Manufacturer Part #: 150060GS75000; Case/Package: 0603; Supplier: JLCPCB; Supplier Part #: C5252984
D402 = LED_Blue_0603: Blue 470nm LED Indication - Discrete 3.2V 0603 (1608 Metric); Manufacturer: Wurth Elektronik; Manufacturer Part #: 150060BS75000; Case/Package: 0603; Supplier: JLCPCB; Supplier Part #: C5197644
J400 = USB4105-GF-A-060_1: as J200 on sheet 2_SurvBot_RCU_MCU; Manufacturer Part Number: TYPE-C-31-M-12; Package: SMD; Supplier: JLCPCB; Supplier Part #: C165948
Q400 Q401 Q403 = MOSFET-N_60V-190mA-SOT23-3: N-Channel 60 V 190mA (Ta), 300mA (Tc) 265mW (Ta), 1.33W (Tc) Surface Mount TO-236AB; Manufacturer: Nexperia; Manufacturer Part #: 2N7002NXAKR; Case/Package: SOT23-3; Supplier: JLCPCB; Supplier Part #: C551416
Q402 = MOSFET-P_50V-180mA-SOT23-3: P-Channel 50 V 180mA (Ta) 350mW (Ta), 1.14W (Tc) Surface Mount TO-236AB; Manufacturer: Nexperia; Manufacturer Part #: BSS84AK,215; Case/Package: SOT-23-3; Supplier: JLCPCB; Supplier Part #: C127273
R400 R403 R405 R406 = RES_10K-100mW-1%-0603: as R500 on sheet 5_SurvBot_RCU_Sensors; Case/Package: 0603; Supplier: JLCPCB; Supplier Part #: C98220
R401 R402 = RES_5.1K-100mW-1%-0603: as R205 on sheet 2_SurvBot_RCU_MCU; Case/Package: 0603; Supplier: JLCPCB; Supplier Part #: C105580
R404 R407 R408 = RES_20R-100mW-1%-0603: 20 Ohms ±1% 0.1W, 1/10W Chip Resistor 0603 (1608 Metric) Moisture Resistant Thick Film; Manufacturer: YAGEO; Manufacturer Part #: RC0603FR-0720RL; Case/Package: 0603; Supplier: JLCPCB; Supplier Part #: C125758
SW = SW_SPDT_JS102011JCQN: Slide Switch SPDT Surface Mount; Manufacturer: C&K; Manufacturer Part #: JS102011JCQN; Case/Package: SMD; Supplier: JLCPCB; Supplier Part #: C221659
SW400 = CMP-2100-03586-2: as SW200 on sheet 2_SurvBot_RCU_MCU; Height: 1.2mm; Width: 3mm; Weight: 0.000776oz; Contact Material: Silver; Max Voltage Rating (DC): 12V; Insulation Resistance: 100MR; Lead Free: Lead Free; Current Rating: 50mA; Termination: SMD/SMT; Length: 4mm; Voltage Rating (DC): 12V; Contact Current Rating: 50mA; Orientation: Straight; Depth: 2.5mm; Max Operating Temperature: 70°C; Packaging: Tape and Reel; Min Operating Temperature: -25°C; Package Quantity: 1; Mount: Surface Mount; Electrical Life: 200000Cycles; Manufacturer Part #: B3U-1000P; Case/Package: SMD, 2.5x3mm; Supplier: JLCPCB; Supplier Part #: C231329
U400 = CH340C-SOP-16_USB_Converter: 2Mbps Transceiver USB 2.0 SOP-16 USB Converters ROHS; Manufacturer: WCH(Jiangsu Qin Heng); Manufacturer Part #: CH340C; Case/Package: SOP-16; Supplier: JLCPCB; Supplier Part #: C7464026
U401 = MCU_ESP32-C3-MINI-1-N4: Bluetooth, WiFi 802.11b/g/n, Bluetooth v5.0 Transceiver Module 2.412GHz ~ 2.484GHz PCB Trace Surface Mount; Manufacturer: Espressif Systems; Manufacturer Part #: ESP32-C3-MINI-1-N4; Case/Package: 53-SMD Module; Supplier: JLCPCB; Supplier Part #: C2838502
U402 = IC_DG2788ADN-T1-GE4: 2 Circuit IC Switch 2:1 500mOhm 16-miniQFN (1.8x2.6); Manufacturer: Vishay Intertech; Manufacturer Part #: DG2788ADN-T1-GE4; Case/Package: UQFN-16(1.8x2.6); Supplier: JLCPCB; Supplier Part #: C222479

## Sheet 7_SurvBot_RCU_ExternalMemory.SchDoc
size A4; SheetNumber: 8; SheetTotal: 8
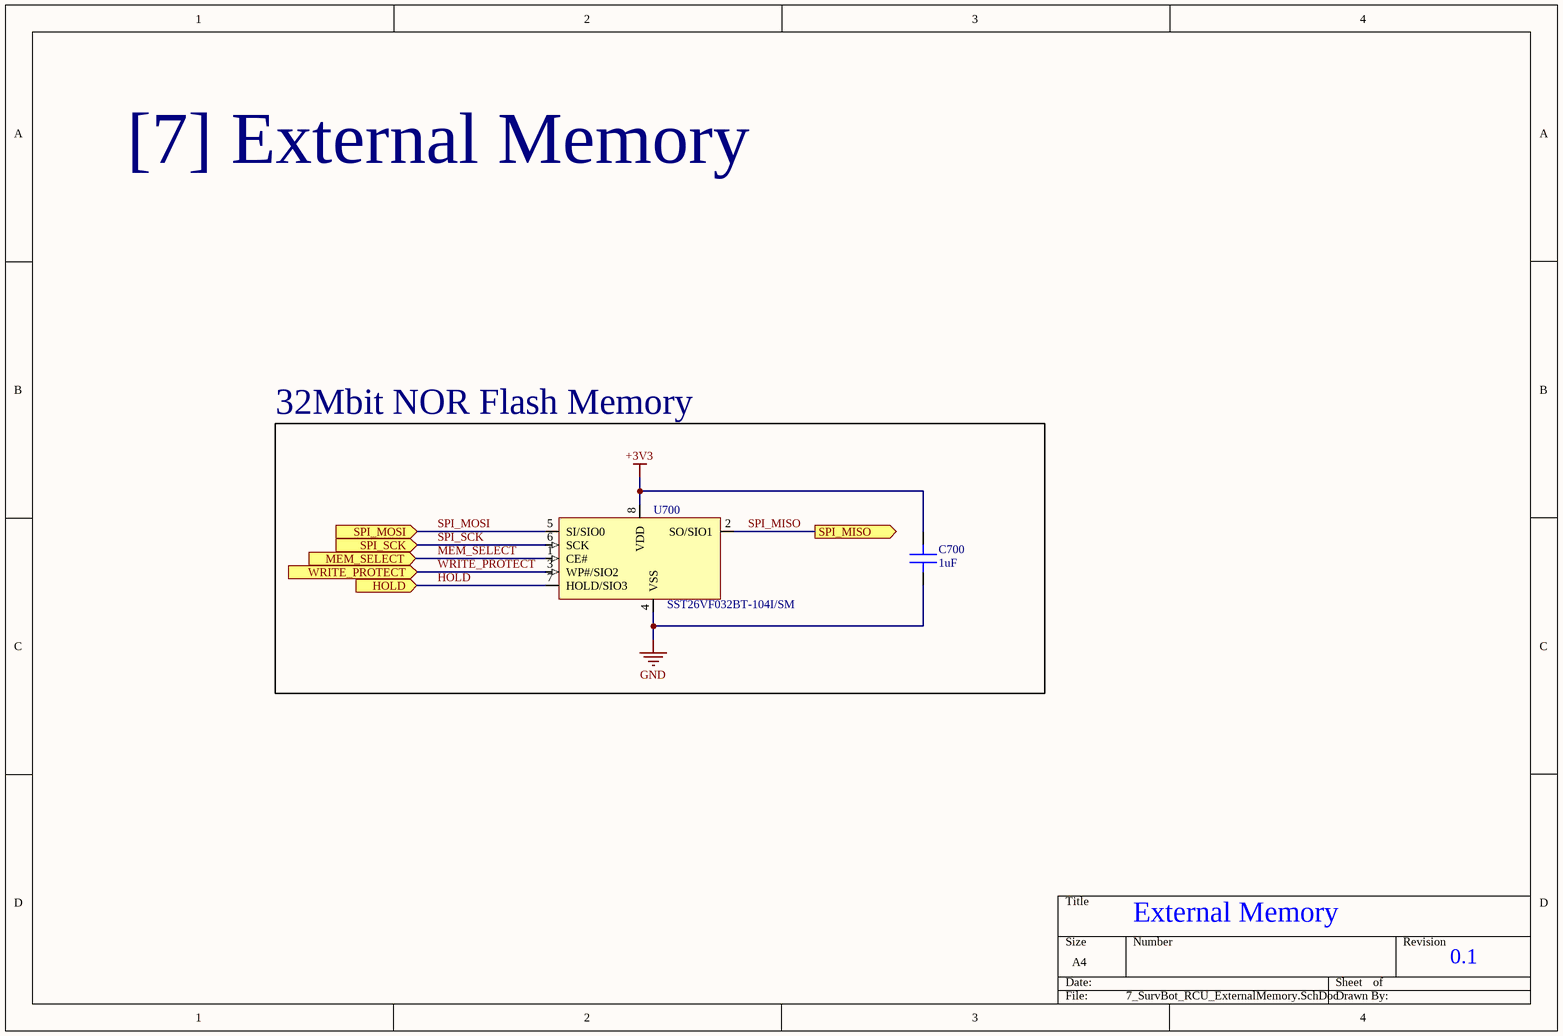
[diagram p8: 7_SurvBot_RCU_ExternalMemory.SchDoc]

### Parts
C700  1uF  [CAP_0603]
U700  SST26VF032BT-104I/SM  [8-SOIC, 5.26x5.25mm]

### Blocks framed on the sheet
32Mbit NOR Flash Memory: C700 U700

### Ports
HOLD (in, see 0_SurvBot_RCU_Overview[1B], 2_SurvBot_RCU_MCU[4A]), MEM_SELECT (in, see 0_SurvBot_RCU_Overview[1B], 2_SurvBot_RCU_MCU[4A]), SPI_MISO (out, see 0_SurvBot_RCU_Overview[1B], 2_SurvBot_RCU_MCU[4A]), SPI_MOSI (in, see 0_SurvBot_RCU_Overview[1B], 2_SurvBot_RCU_MCU[4A]), SPI_SCK (in, see 0_SurvBot_RCU_Overview[1B], 2_SurvBot_RCU_MCU[4A]), WRITE_PROTECT (in, see 0_SurvBot_RCU_Overview[1B], 2_SurvBot_RCU_MCU[4A])

### Nets
+3V3: C700.2 U700.8(VDD)
GND: C700.1 U700.4(VSS)
HOLD: U700.7(HOLD/SIO3) ; port HOLD
MEM_SELECT: U700.1(CE#) ; port MEM_SELECT
SPI_MISO: U700.2(SO/SIO1) ; port SPI_MISO
SPI_MOSI: U700.5(SI/SIO0) ; port SPI_MOSI
SPI_SCK: U700.6(SCK) ; port SPI_SCK
WRITE_PROTECT: U700.3(WP#/SIO2) ; port WRITE_PROTECT

### Notes on the sheet
- [7] External Memory
- External Memory
- 0.1

### Library data of the parts
C700 = CAP_1uF-16V-10%-0603: as C107 on sheet 1_SurvBot_RCU_Power; Case/Package: 0603; Supplier: JLCPCB; Supplier Part #: C106248
U700 = IC_SST26VF032BT-104I/SM: FLASH Memory IC 32Mbit SPI - Quad I/O 104 MHz 8-SOIJ; Manufacturer: Microchip Tech; Manufacturer Part #: SST26VF032BT-104I/SM; Case/Package: 8-SOIC; Supplier: JLCPCB; Supplier Part #: C69337

## Nets that join several sheets
+3V3: 1_SurvBot_RCU_Power (C105.2 C106.2 L101.2 U101.1), 2_SurvBot_RCU_MCU (11 pins), 3_SurvBot_RCU_MotorControl (8 pins), 5_SurvBot_RCU_Sensors (10 pins), 4_SurvBot_RCU_Bluetooth (14 pins), 7_SurvBot_RCU_ExternalMemory (C700.2 U700.8)
+3V3A: 1_SurvBot_RCU_Power (C110.2 U102.2), 6_SurvBot_RCU_CurrentFeedback (10 pins)
+6V: 1_SurvBot_RCU_Power (C102.1 L100.2 R100.2), 3_SurvBot_RCU_MotorControl (12 pins)
GND: 1_SurvBot_RCU_Power (19 pins), 2_SurvBot_RCU_MCU (21 pins), 3_SurvBot_RCU_MotorControl (28 pins), 6_SurvBot_RCU_CurrentFeedback (15 pins), 5_SurvBot_RCU_Sensors (12 pins), 4_SurvBot_RCU_Bluetooth (43 pins), 7_SurvBot_RCU_ExternalMemory (C700.1 U700.4)
VBUS1: 1_SurvBot_RCU_Power (C107.2 L102.1), 2_SurvBot_RCU_MCU (D201.5 J200.A4B9 J200.B4A9)
VBUS2: 1_SurvBot_RCU_Power (C111.2 L103.1), 4_SurvBot_RCU_Bluetooth (D400.5 J400.A4B9 J400.B4A9)
AWAKE_SLEEP: 2_SurvBot_RCU_MCU (U200.25), 3_SurvBot_RCU_MotorControl (U301.3 U303.3)
BUFFERED_L_SENSED_MOTOR_CURRENT: 3_SurvBot_RCU_MotorControl (U302.1 U302.4), 6_SurvBot_RCU_CurrentFeedback (R602.2)
BUFFERED_R_SENSED_MOTOR_CURRENT: 3_SurvBot_RCU_MotorControl (U300.1 U300.4), 6_SurvBot_RCU_CurrentFeedback (R600.2)
CTR_MODE: 2_SurvBot_RCU_MCU (U200.26), 3_SurvBot_RCU_MotorControl (U301.16 U303.16)
HOLD: 2_SurvBot_RCU_MCU (U200.40), 7_SurvBot_RCU_ExternalMemory (U700.7)
I2C_SCL: 2_SurvBot_RCU_MCU (R202.1 U200.23), 6_SurvBot_RCU_CurrentFeedback (U601.5 U603.5), 5_SurvBot_RCU_Sensors (U500.1 U501.13 U502.4)
I2C_SDA: 2_SurvBot_RCU_MCU (R201.2 U200.22), 6_SurvBot_RCU_CurrentFeedback (U601.6 U603.6), 5_SurvBot_RCU_Sensors (U500.2 U501.14 U502.1)
L_EN/PWM: 2_SurvBot_RCU_MCU (U200.48), 3_SurvBot_RCU_MotorControl (U303.1)
L_PH/PWM: 2_SurvBot_RCU_MCU (U200.20), 3_SurvBot_RCU_MotorControl (U303.2)
L_WHEEL_ENC_A: 2_SurvBot_RCU_MCU (U200.17), 3_SurvBot_RCU_MotorControl (R308.1 R310.2)
L_WHEEL_ENC_B: 2_SurvBot_RCU_MCU (U200.18), 3_SurvBot_RCU_MotorControl (R309.1 R311.2)
MEM_SELECT: 2_SurvBot_RCU_MCU (U200.45), 7_SurvBot_RCU_ExternalMemory (U700.1)
nFAULT_L: 2_SurvBot_RCU_MCU (U200.39), 3_SurvBot_RCU_MotorControl (R306.2 U303.4)
nFAULT_R: 2_SurvBot_RCU_MCU (U200.38), 3_SurvBot_RCU_MotorControl (R300.2 U301.4)
R_EN/PWM: 2_SurvBot_RCU_MCU (U200.15), 3_SurvBot_RCU_MotorControl (U301.1)
R_PH/PWM: 2_SurvBot_RCU_MCU (U200.14), 3_SurvBot_RCU_MotorControl (U301.2)
R_WHEEL_ENC_A: 2_SurvBot_RCU_MCU (U200.11), 3_SurvBot_RCU_MotorControl (R302.1 R304.2)
R_WHEEL_ENC_B: 2_SurvBot_RCU_MCU (U200.12), 3_SurvBot_RCU_MotorControl (R303.1 R305.2)
SPI_MISO: 2_SurvBot_RCU_MCU (U200.43), 7_SurvBot_RCU_ExternalMemory (U700.2)
SPI_MOSI: 2_SurvBot_RCU_MCU (U200.44), 7_SurvBot_RCU_ExternalMemory (U700.5)
SPI_SCK: 2_SurvBot_RCU_MCU (U200.42), 7_SurvBot_RCU_ExternalMemory (U700.6)
UART_MCU_RX: 2_SurvBot_RCU_MCU (U200.29), 4_SurvBot_RCU_Bluetooth (U402.15)
UART_MCU_TX: 2_SurvBot_RCU_MCU (U200.32), 4_SurvBot_RCU_Bluetooth (U402.11)
WRITE_PROTECT: 2_SurvBot_RCU_MCU (U200.41), 7_SurvBot_RCU_ExternalMemory (U700.3)